# Altium project SAMV71_Xplained_Ultra.PrjPCB (part 3 of 5)

## Sheet SAMV71_Xplained_Ultra_Power_Supply.SchDoc: Power supply
size A3; Organization: ATMEL Norway; Address1: Vestre Rosten 79; Address2: N-7075 TILLER; Address3: NORWAY; DocumentNumber: A09-2407; Revision: 3; SheetNumber: 2; SheetTotal: 13; PageSetup: Record=PageOptions|CenterHorizontal=True|CenterVertical=True|PrintScale=1.01|XCorrection=1.00|YCorrection=1.00|PrintKind=1|BorderSize=5000000|LeftOffset=0|BottomOffset=0|Orientation=2|PaperLength=1000|PaperWidth=1000|Scale=100|PaperSource=7|PrintQuality=-4|MediaType=1|DitherType=10|PaperKind=A3 (297 x 420 mm)|PrintScaleMode=1
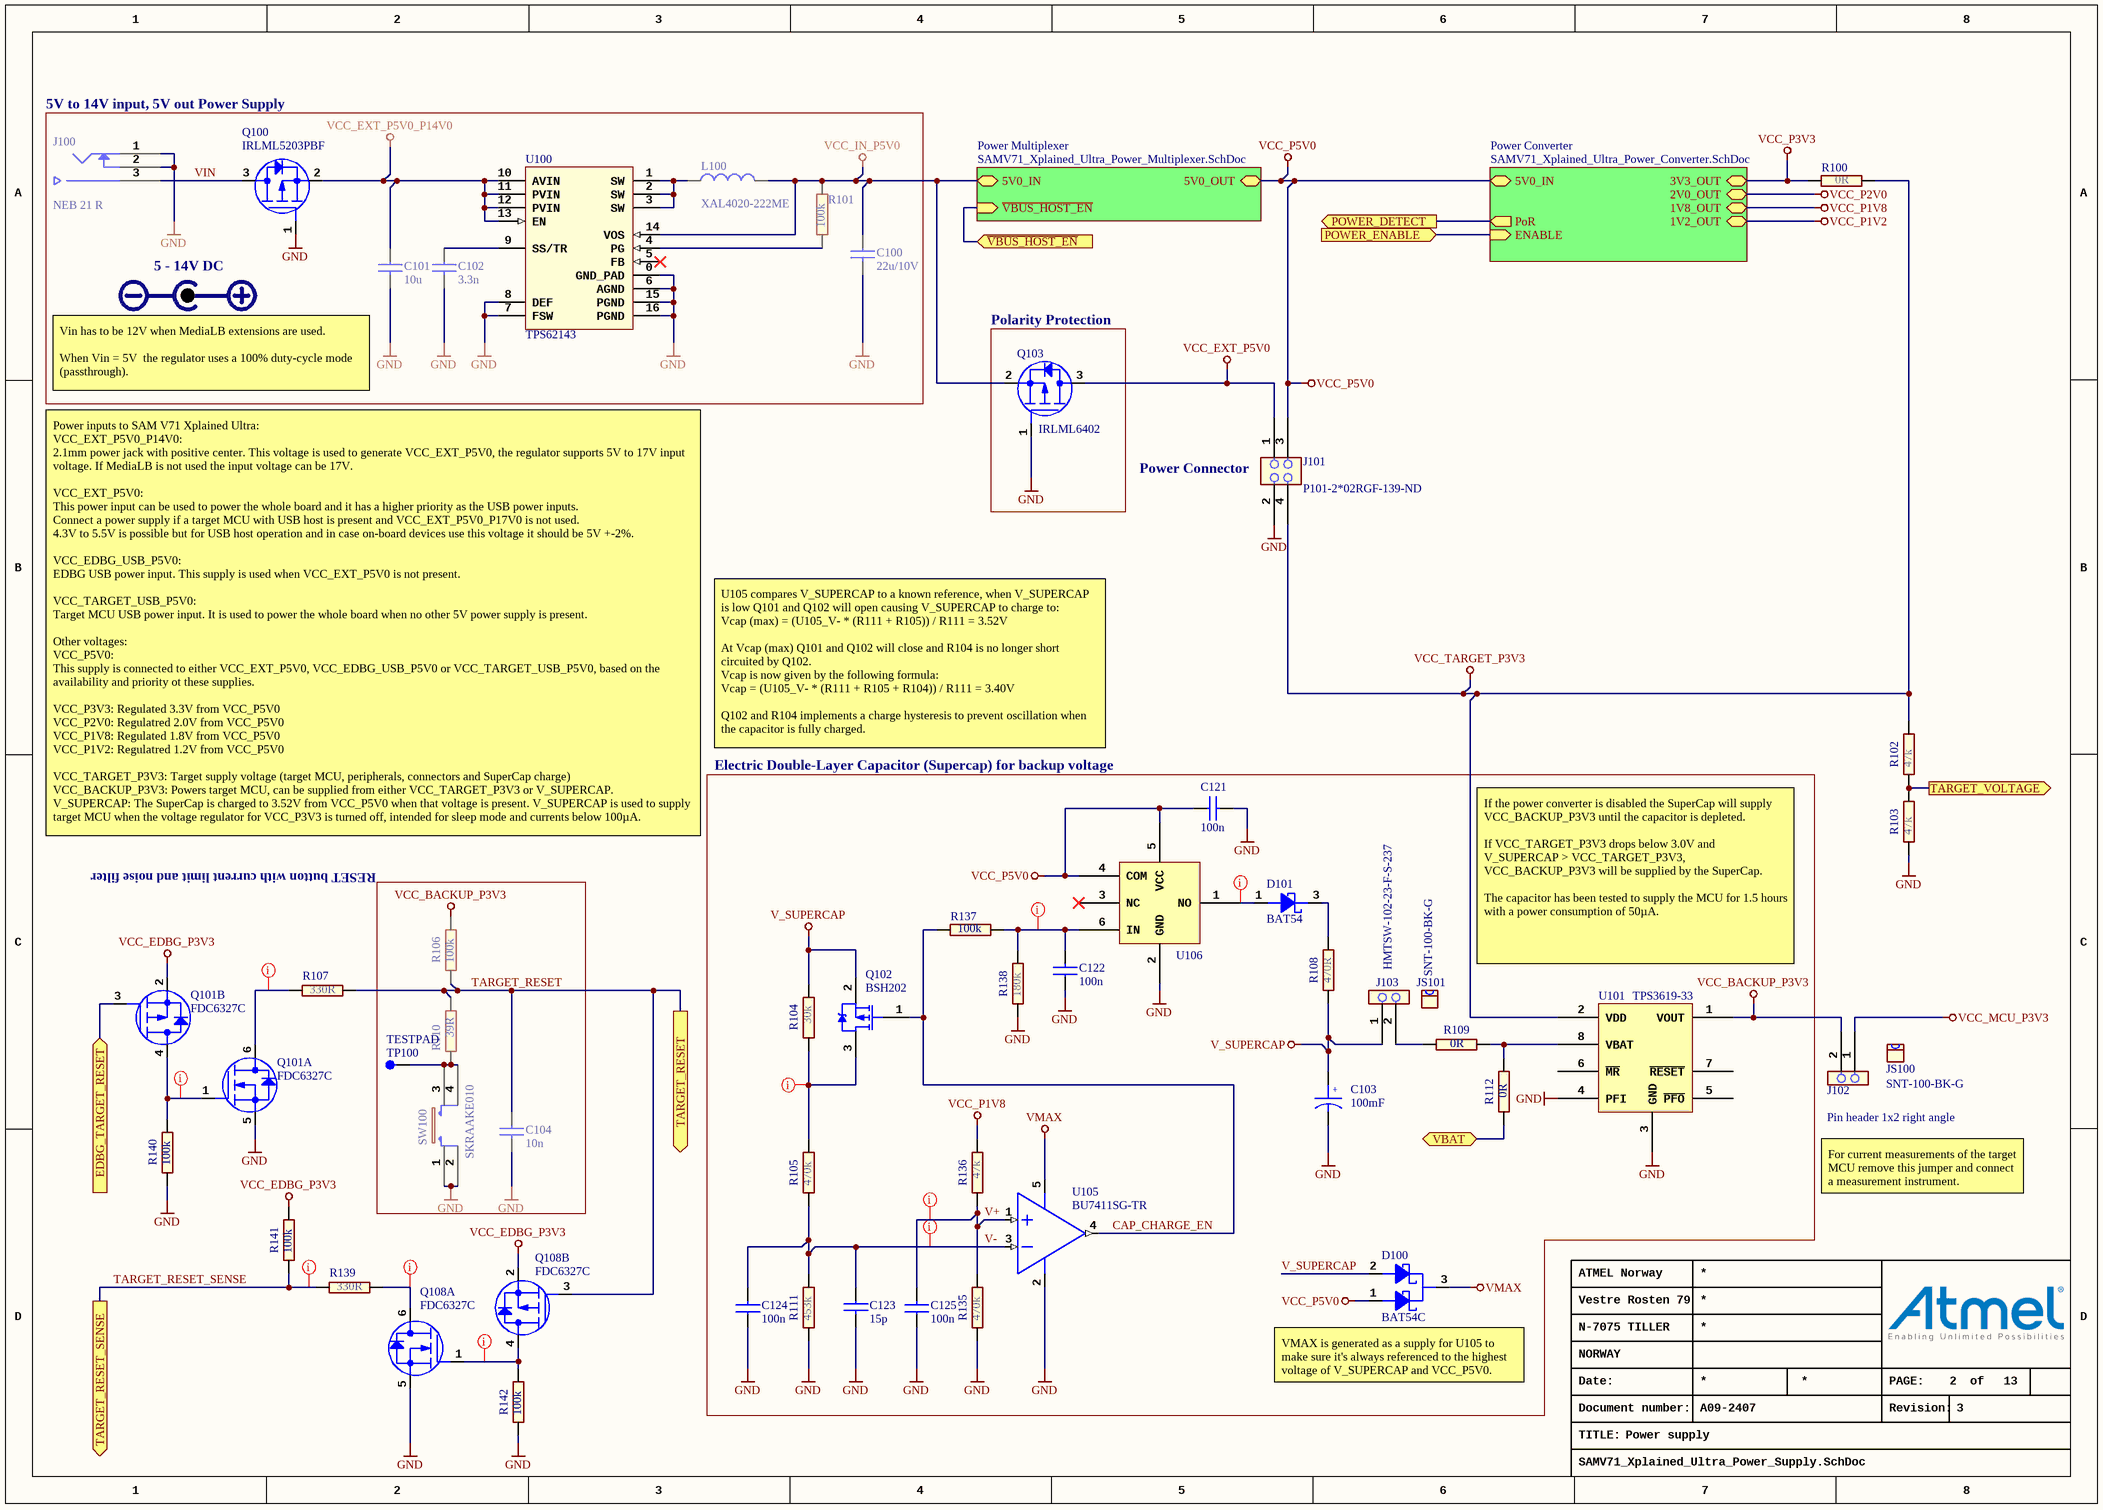
[diagram p4: SAMV71_Xplained_Ultra_Power_Supply.SchDoc]

### Parts
C100  value 22u/10V  [AP1-00003]
C101  value 10u  [AP1-00003]
C102  value 3.3n  [AP1-00001]
C103  value 100mF  [AP1-00122]  (hidden comment: For reflow soldering)
C104  value 10n  [AP1-00053]
C121  value 100n  [AP1-00001]
C122  value 100n  [AP1-00053]
C123  value 15p  [AP1-00001]
C124  value 100n  [AP1-00001]
C125  value 100n  [AP1-00001]
D100  value BAT54C  [AP5-00002]
D101  value BAT54  [AP4-00007]
J100  value NEB 21 R  [AP8-00853]
J101  value P101-2*02RGF-139-ND  [AP8-00628]
J102  value Pin header 1x2 right angle  [AP8-00367]
J103  value HMTSW-102-23-F-S-237  [AP8-00733]
JS100  value SNT-100-BK-G  [AP8-00525]
JS101  value SNT-100-BK-G  [AP8-00525]
L100  value XAL4020-222ME  [AP3-00119]
Q100  value IRLML5203PBF  [AP5-00002]
Q101  value FDC6327C  [AP5-00008]  (hidden comment: Farnell no: 9844856)  (parts A,B of 2)
Q102  value BSH202  [AP4-00018]
Q103  value IRLML6402  [AP5-00002]
Q108  value FDC6327C  [AP5-00008]  (hidden comment: Farnell no: 9844856)  (parts A,B of 2)
R100  value 0R  [AP2-00000]
R101  value 100k  [AP2-00000]
R102  value 47k  [AP2-00000]
R103  value 47k  [AP2-00000]
R104  value 30k  [AP2-00000]
R105  value 470k  [AP2-00000]
R106  value 100k  [AP2-00011]
R107  value 330R  [AP2-00011]
R108  value 470R  [AP2-00000]
R109  value 0R  [AP2-00000]
R110  value 39R  [AP2-00011]
R111  value 453k  [AP2-00000]
R112  value 0R  [AP2-00000]
R135  value 470k  [AP2-00000]
R136  value 47k  [AP2-00000]
R137  value 100k  [AP2-00011]
R138  value 180k  [AP2-00011]
R139  value 330R  [AP2-00011]
R140  value 100k  [AP2-00011]
R141  value 100k  [AP2-00011]
R142  value 100k  [AP2-00011]
SW100  value SKRAAKE010  [AP8-00137]  (hidden comment: Can be ordered in low volumes from Mouser)
TP100  value TESTPAD  [AP8-00010]  (no BOM)
U100  value TPS62143  [AP6-00313]  (hidden comment: 100% duty-cycle mode, supports input voltage close to 5V with 5V output!)
U101  value TPS3619-33  [AP6-00382]
U105  value BU7411SG-TR  [AP6-00087]
U106  (no value)  [AP6-00056]

### Blocks framed on the sheet
Polarity Protection: Q103
RESET button with current limit and noise filter: C104 R106 R110 SW100 TP100

### Sub-sheets
Power Converter = SAMV71_Xplained_Ultra_Power_Converter.SchDoc: 2V0_OUT (bidir), 3V3_OUT, 5V0_IN, 1V2_OUT, 1V8_OUT, ENABLE (in), PoR (out)
Power Multiplexer = SAMV71_Xplained_Ultra_Power_Multiplexer.SchDoc: ~{VBUS_HOST_EN} (in), 5V0_OUT, 5V0_IN

### Ports
EDBG_TARGET_RESET (in), POWER_DETECT (out), POWER_ENABLE (in), TARGET_RESET (out), TARGET_RESET_SENSE (out), TARGET_VOLTAGE (out), VBAT (bidir), ~{VBUS_HOST_EN} (in)

### Nets
GND: C100.2 C101.2 C102.2 C103.2 C104.2 C121.2 C122.1 C123.2 C124.1 C125.1 J100.1 J100.2 J101.2 Q100.1(G) Q101.5(S) Q103.1(G) Q108.5(S) R103.1 R111.1 R135.1 R138.1 R140.1 R142.1 SW100.1 SW100.2 U100.0(GND_PAD) U100.6(AGND) U100.7(FSW) U100.8(DEF) U100.15(PGND) U100.16(PGND) U101.3(GND) U101.4(PFI) U105.2(GND) U106.2(GND)
V_SUPERCAP: C103.1 D100.2(ANODE2) J103.1 Q102.2(S) R104.2 R108.2
VCC_BACKUP_P3V3: J102.2 R106.2 U101.1(VOUT)
VCC_EDBG_P3V3: Q101.2(S) Q108.2(S) R141.2
VCC_EXT_P5V0: J101.1 Q103.3(D)
VCC_EXT_P5V0_P14V0: C101.1 Q100.2(S) U100.10(AVIN) U100.11(PVIN) U100.12(PVIN) U100.13(EN)
VCC_IN_P5V0: C100.1 L100.2 Q103.2(S) R101.1 U100.14(VOS) ; sheet Power Multiplexer/5V0_IN
VCC_MCU_P3V3: J102.1
VCC_P1V8: R136.2 ; sheet Power Converter/1V8_OUT
VCC_P3V3: R100.1 ; sheet Power Converter/3V3_OUT
VCC_P5V0: C121.1 D100.1(ANODE1) J101.3 U106.4(COM) U106.5(VCC) ; sheet Power Multiplexer/5V0_OUT, sheet Power Converter/5V0_IN
VCC_TARGET_P3V3: J101.4 R100.2 R102.2 U101.2(VDD)
VMAX: D100.3(CATHODE) U105.5(VCC)
CAP_CHARGE_EN: Q102.1(G) R137.1 U105.4(OUT)
EDBG_ADC0: R102.1 R103.2 ; port TARGET_VOLTAGE
EDBG_TARGET_RESET: Q101.3(G) ; port EDBG_TARGET_RESET
PA01: port POWER_DETECT, sheet Power Converter/PoR
PC17: port POWER_ENABLE, sheet Power Converter/ENABLE
TARGET_RESET: C104.1 Q108.3(G) R106.1 R107.2 R110.2 ; port TARGET_RESET
TARGET_RESET_SENSE: R139.1 R141.1 ; port TARGET_RESET_SENSE
TARGET_USB_ID: port ~{VBUS_HOST_EN}, sheet Power Multiplexer/~{VBUS_HOST_EN}
V+: C125.2 R135.2 R136.1 U105.1(IN+)
V-: C123.1 C124.2 R105.1 R111.2 U105.3(IN-)
VBAT: R112.1 ; port VBAT
VIN: J100.3 Q100.3(D)
NetC102_1: C102.1 U100.9(SS/TR)
NetC122_2: C122.2 R137.2 R138.2 U106.6(IN)
NetD101_1: D101.1(ANODE) U106.1(NO)
NetD101_3: D101.3(CATHODE) R108.1
NetJ103_2: J103.2 R109.1
NetL100_1: L100.1 U100.1(SW) U100.2(SW) U100.3(SW)
NetQ101_1: Q101.1(G) Q101.4(D) R140.2
NetQ101_6: Q101.6(D) R107.1
NetQ102_3: Q102.3(D) R104.1 R105.2
NetQ108_1: Q108.1(G) Q108.4(D) R142.2
NetQ108_6: Q108.6(D) R139.2
NetR101_2: R101.2 U100.4(PG)
NetR109_2: R109.2 R112.2 U101.8(VBAT)
NetR110_1: R110.1 SW100.3 SW100.4 TP100.1

Not connected (* = marked no-connect by the designer): U100 5(FB)*; U101 5(~{PFO}) 6(~{MR}) 7(~{RESET}); U106 3(NC)*

### Layout directives
rule Fabrication Testpoint Usage [Testpoint - Not Allowed    Multiple - Not Allowed]; rule Assembly Testpoint Usage [Testpoint - Not Allowed    Multiple - Not Allowed]: NetC122_2, NetD101_1, NetQ102_3, V+, V-
rule Assembly Testpoint Usage [Testpoint - Not Allowed    Multiple - Not Allowed]; rule Fabrication Testpoint Usage [Testpoint - Not Allowed    Multiple - Not Allowed]: NetQ101_1, NetQ101_6, NetQ108_1, NetQ108_6, TARGET_RESET_SENSE

### Notes on the sheet
- (near J100) 5V to 14V input, 5V out Power Supply
- (near Q100) 5 - 14V DC
- (near C101) Vin has to be 12V when MediaLB extensions are used.
  When Vin = 5V  the regulator uses a 100% duty-cycle mode (passthrough).
- (near J101) Power Connector
- Electric Double-Layer Capacitor (Supercap) for backup voltage
- U105 compares V_SUPERCAP to a known reference, when V_SUPERCAP is low Q101 and Q102 will open causing V_SUPERCAP to charge to:
  Vcap (max) = (U105_V- * (R111 + R105)) / R111 = 3.52V
  At Vcap (max) Q101 and Q102 will close and R104 is no longer short circuited by Q102.
  Vcap is now given by the following formula:
  Vcap = (U105_V- * (R111 + R105 + R104)) / R111 = 3.40V
  Q102 and R104 implements a charge hysteresis to prevent oscillation when the capacitor is fully charged.
- Power inputs to SAM V71 Xplained Ultra:
  VCC_EXT_P5V0_P14V0:
  2.1mm power jack with positive center. This voltage is used to generate VCC_EXT_P5V0, the regulator supports 5V to 17V input voltage. If MediaLB is not used the input voltage can be 17V.
  VCC_EXT_P5V0:
  This power input can be used to power the whole board and it has a higher priority as the USB power inputs.
  Connect a power supply if a target MCU with USB host is present and VCC_EXT_P5V0_P17V0 is not used.
  4.3V to 5.5V is possible but for USB host operation and in case on-board devices use this voltage it should be 5V +-2%.
  VCC_EDBG_USB_P5V0:
  EDBG USB power input. This supply is used when VCC_EXT_P5V0 is not present.
  VCC_TARGET_USB_P5V0:
  Target MCU USB power input. It is used to power the whole board when no other 5V power supply is present.
  Other voltages:
  VCC_P5V0:
  This supply is connected to either VCC_EXT_P5V0, VCC_EDBG_USB_P5V0 or VCC_TARGET_USB_P5V0, based on the availability and priority ot these supplies.
  VCC_P3V3: Regulated 3.3V from VCC_P5V0
  VCC_P2V0: Regulatred 2.0V from VCC_P5V0
  VCC_P1V8: Regulated 1.8V from VCC_P5V0
  VCC_P1V2: Regulatred 1.2V from VCC_P5V0
  VCC_TARGET_P3V3: Target supply voltage (target MCU, peripherals, connectors and SuperCap charge)
  VCC_BACKUP_P3V3: Powers target MCU, can be supplied from either VCC_TARGET_P3V3 or V_SUPERCAP.
  V_SUPERCAP: The SuperCap is charged to 3.52V from VCC_P5V0 when that voltage is present. V_SUPERCAP is used to supply target MCU when the voltage regulator for VCC_P3V3 is turned off, intended for sleep mode and currents below 100µA.
- If the power converter is disabled the SuperCap will supply VCC_BACKUP_P3V3 until the capacitor is depleted.
  If VCC_TARGET_P3V3 drops below 3.0V and V_SUPERCAP > VCC_TARGET_P3V3, VCC_BACKUP_P3V3 will be supplied by the SuperCap.
  The capacitor has been tested to supply the MCU for 1.5 hours with a power consumption of 50µA.
- For current measurements of the target MCU remove this jumper and connect a measurement instrument.
- (near D100) VMAX is generated as a supply for U105 to make sure it's always referenced to the highest voltage of V_SUPERCAP and VCC_P5V0.
- Date:
- PAGE:
- of
- TITLE:
- Document number:
- Revision:
- (in symbol A01-0679) +

### Library data of the parts
C100 = A01-0500: Ceramic capacitor, SMD 0805, X5R, 10V, Â±20%; PartGroup: Capacitors,Ceramic,SMD 0805; Manufacturer: tdk; MPN: C2012X5R1A226M/0.85; TemperatureRange: -55Â°C to +85Â°C; AN: A01-0500; Height: 0,949999988079071
C101 = A01-0634: Ceramic capacitor, SMD 0805, X5R, 25V, Â±10%; PartGroup: Capacitors,Ceramic,SMD 0805; Manufacturer: Murata; MPN: GRM21BR61E106KA73L; TemperatureRange: -55 Â°C to +85 Â°C; AN: A01-0634; Tolerance: Â±10%; Height: 1,25
C102 = A01-0044: Ceramic capacitor, SMD 0402, X7R, 25V, +/-10%; PartGroup: Capacitors,Ceramic,SMD 0402; TemperatureRange: -55 - +125 deg C; AN: A01-0044; Tolerance: 25V, +/-10%; Height: 0,550000011920929
C103 = A01-0679: Electric Double-Layer (Supercapacitor), 100mF, SMD, 10.5mm diameter, 25Î© ESR; PartGroup: Capacitors,Other; Manufacturer: Kemet; MPN: FC0H104ZFTBR24; Tolerance: -20/+80%; TemperatureRange: -25Â°C to +70Â°C; AN: A01-0679; Height: 5,5
C104 = A01-0050: Ceramic capacitor, SMD 0402, X7R, 25V, +/-10%; PartGroup: Capacitors,Ceramic,SMD 0402; TemperatureRange: -55 - +125 deg C; AN: A01-0050; Tolerance: 25V, +/-10%; Height: 0,550000011920929
C121 C122 C124 C125 = A01-0246: Ceramic capacitor, SMD 0402, X7R, 16V, +/-10%; PartGroup: Capacitors,Ceramic,SMD 0402; Manufacturer: Kemet; MPN: C0402C104K4RACTU; TemperatureRange: -55 - +125 deg C; AN: A01-0246; Tolerance: 16V, +/-10%; Height: 0,5
C123 = A01-0017: Ceramic capacitor, SMD 0402, NP0, 50V, +/-5%; PartGroup: Capacitors,Ceramic,SMD 0402; TemperatureRange: -55 - +125 deg C; AN: A01-0017; Tolerance: 50V, +/-5%; Height: 0,550000011920929
D100 = A04-0064: Schottky double Diodes, NXP, SOT23-3; PartGroup: Diodes,Schottky; AN: A04-0064; Height: 1; Manufacturer: NXP; MPN: BAT54C
D101 = A04-0001: Schottky diode, V(rrm)=30V, I(f)=0.1A, V(f)=0.4V (at If = 0.01A), I(r)=0.5uA (at Vrrm), t(rr)=5ns, SMD SOT23; PartGroup: Diodes,Schottky; Manufacturer: Philips; NC: 2; TemperatureRange: -40 - +85 deg C; AN: A04-0001; Height: 1,10000002384186; MPN: BAT54
J100 = A08-2120: Through hole DC jack 2.1mm, 12V, 3A; PartGroup: Mechanical devices,Connectors,Power; Manufacturer: Lumberg; TemperatureRange: -20Â°C to +70Â°C; AN: A08-2120; Height: 11; MPN: NEB 21 R
J101 = A08-1519: Pin header, 2x2, Right Angle, 2.54mm, THT, Pin In Paste; PartGroup: Mechanical devices,Connectors,Pin headers; Manufacturer: Pro-data International Corp; AN: A08-1519; Height: 5,07999992370605; MPN: P101-2*02RGF-139-ND
J102 = A08-0764: 1x2 pin header, right angle, 2.54 mm pitch, through-hole; PartGroup: Mechanical devices,Connectors,Pin headers; Manufacturer: Pro-data International Corp; MPN: 2213R-2G; AN: A08-0764; Height: 2,53999996185303
J103 = A08-1754: 1x2 pin header, 2.54mm pitch, Pin-in-Paste THM; PartGroup: Mechanical devices,Connectors,Pin headers; Manufacturer: SAMTEC; TemperatureRange: - 55 deg C to + 125 deg C; AN: A08-1754; Height: 6,09999990463257; MPN: HMTSW-102-23-F-S-237
JS100 JS101 = A08-0543: Jumper cap for 2.54mm pinheader; PartGroup: Mechanical devices,Mounting accessories,Other; Manufacturer: SAMTEC; AN: A08-0543; MPN: SNT-100-BK-G
L100 = A03-0197: 2.2ÂµH Shielded Power Inductor, 4x4x2mm, Isat=5.6A , Irms=4.0A , DCR=35.2mÎ©; PartGroup: Inductors,Power Inductors; Manufacturer: Coilcraft; MPN: XAL4020-222MEC; Tolerance: 20%; TemperatureRange: â€“40Â°C to +125Â°C; AN: A03-0197; Height: 2
Q100 = A05-0023: P-ch. MOSFET. -30V, -3.0A continuous, -24A Peak. RDS(ON)=0.098Ohm@VGS=-10V, RDS(ON)=0.165Ohm@VGS=-4.5V, -2.5V<VGS(th)<-1.0V; PartGroup: Transistors,Power FET,SMD; Manufacturer: International Rectifier; TemperatureRange: -40C to +125; AN: A05-0023; Height: 1,12000000476837; MPN: IRLML5203PBF
Q101 Q108 = A05-0040: Dual N/P-ch MOSFET, 20V, 2.7A/-1.9A cont, 8A/-8A pulse, RDS(ON)<0.08/0.17Ohm@VGS=4.5V, VGS(th)<1.5/-1.5V, SSOT6; PartGroup: Transistors,Power FET,SMD; Manufacturer: Fairchild; TemperatureRange: -55 - +150 deg C; AN: A05-0040; Height: 1,10000002384186; MPN: FDC6327C
Q102 = A05-0134: P-channel Power MOSFET,30V, 520mA continuous drain current; PartGroup: Transistors,Power FET,SMD; Manufacturer: NXP; Design comment: *; AN: A05-0134; MPN: BSH202
Q103 = A05-0087: P-ch. MOSFET. -30V, -3.7A continuous,RDS(ON)=0.05Ohm@VGS=-4,5V, RDS(ON)=0.08Ohm@VGS=-2.5V; PartGroup: Transistors,Power FET,SMD; Manufacturer: International Rectifier; MPN: IRLML6402PBF; TemperatureRange: -55 - +150 deg C; AN: A05-0087; Height: 1,14999997615814
R100 = A02-0163: Thick film resistor, SMD 0402, 1/16W, 1%; PartGroup: Resistors,SMD,0402 1%; Manufacturer: (n/a); MPN: RMCF0402ZT0R00; TemperatureRange: -55 - +125 deg C; AN: A02-0163; Tolerance: 1 %; Height: 0,349999994039536
R101 R106 R137 R140-R142 = A02-0260: Thick film resistor, SMD 0402, 1/16W, 1%; PartGroup: Resistors,SMD,0402 1%; TemperatureRange: -55ï¿½ to +125ï¿½C; AN: A02-0260; Tolerance: 1 %; Height: 0,349999994039536
R102 R103 R136 = A02-0252: Thick film resistor, SMD 0402, 1/16W, 1%; PartGroup: Resistors,SMD,0402 1%; TemperatureRange: -55 - +125 deg C; AN: A02-0252; Tolerance: 1 %; Height: 0,349999994039536
R104 = A02-0247: Thick film resistor, SMD 0402, 1/16W, 1%; PartGroup: Resistors,SMD,0402 1%; TemperatureRange: -55ï¿½ to +155ï¿½C; AN: A02-0247; Tolerance: 1 %; Height: 0,349999994039536
R105 R135 = A02-0276: Thick film resistor, SMD 0402, 1/16W, 1%; PartGroup: Resistors,SMD,0402 1%; TemperatureRange: -55 - +125 deg C; AN: A02-0276; Tolerance: 1 %; Height: 0,349999994039536
R107 R139 = A02-0200: Thick film resistor, SMD 0402, 1/16W, 1%; PartGroup: Resistors,SMD,0402 1%; TemperatureRange: -55 - +125 deg C; AN: A02-0200; Tolerance: 1 %; Height: 0,349999994039536
R108 = A02-0204: Thick film resistor, SMD 0402, 1/16W, 1%; PartGroup: Resistors,SMD,0402 1%; TemperatureRange: -55 - +125 deg C; AN: A02-0204; Tolerance: 1 %; Height: 0,349999994039536
R109 R112 = A02-0163: RES 0.0 OHM 1/16W 0402 SMD; PartGroup: Resistors,SMD,0402 1%; Manufacturer: (n/a); MPN: RMCF0402ZT0R00; Tolerance: 1 %; TemperatureRange: -55 - +125 deg C; AN: A02-0163; Height: 0,349999994039536
R110 = A02-0178: Thick film resistor, SMD 0402, 1/16W, 1%; PartGroup: Resistors,SMD,0402 1%; TemperatureRange: -55 - +125 deg C; AN: A02-0178; Tolerance: 1 %; Height: 0,349999994039536
R111 = A02-0925: Thick film resistor, SMD 0402, 1/16W, 1%; PartGroup: Resistors,SMD,0402 1%; TemperatureRange: -55 - +125 deg C; AN: A02-0925; Tolerance: 1 %; Height: 0,349999994039536
R138 = A02-0266: Thick film resistor, SMD 0402, 1/16W, 1%; PartGroup: Resistors,SMD,0402 1%; TemperatureRange: -55 - +125 deg C; AN: A02-0266; Tolerance: 1 %; Height: 0,349999994039536
SW100 = A08-0790: 6.2x6.2 mm SMD tact switch, same as A08-0091 but less force is needed; PartGroup: Mechanical devices,Switches,SMD; Manufacturer: ALPS; TemperatureRange: -30 - +90 deg C; AN: A08-0790; Height: 5,09999990463257; MPN: SKRAAKE010
TP100 = A08-0004: Single SMD testpad; PartGroup: Mechanical devices,Connectors,Test points; AN: A08-0004; Height: 0
U100 = A06-1167: 5V to 17V in, 5V 2A out, Step-Down Converter; PartGroup: Integrated Circuits,Regulators,Switched; Manufacturer: Texas Instruments; MPN: TPS62143RGTR; TemperatureRange: -40C to 85C; AN: A06-1167; Height: 1
U101 = A06-1100: Backup battery supervisors for RAM retention; PartGroup: Integrated Circuits,Special function,Supervisor; Manufacturer: Texas Instruments; MPN: TPS3619-33DGK; Design comment: *; AN: A06-1100
U105 = A06-1239: Single, Low Voltage (1.6-5.5V), Low Power (0.35ÂµA), low cost; PartGroup: Integrated Circuits,General linear,OP-AMP; Manufacturer: ROHM; TemperatureRange: -40Â°C to +105Â°C; AN: A06-1239; Height: 1,25; MPN: BU7411SG-TR
U106 = A06-1104: 1.65V to 5.5V SPDT Analog switch; PartGroup: Integrated Circuits,General linear,Analog switch, bus switch and MUX; Manufacturer: Texas Instruments; Value: TS5A3160DBVR; Design comment: *; AN: A06-1104; MPN: TS5A3160DBVR

## Sheet SAMV71_Xplained_Ultra_Power_Multiplexer.SchDoc: Power Multiplexer
size A3; Organization: ATMEL Norway; Address1: Vestre Rosten 79; Address2: N-7075 TILLER; Address3: NORWAY; DocumentNumber: A09-2407; Revision: 3; SheetNumber: 3; SheetTotal: 13; PageSetup: Record=PageOptions|CenterHorizontal=True|CenterVertical=True|PrintScale=1.01|XCorrection=1.00|YCorrection=1.00|PrintKind=1|BorderSize=5000000|LeftOffset=0|BottomOffset=0|Orientation=2|PaperLength=1000|PaperWidth=1000|Scale=100|PaperSource=7|PrintQuality=-4|MediaType=1|DitherType=10|PaperKind=A3 (297 x 420 mm)|PrintScaleMode=1
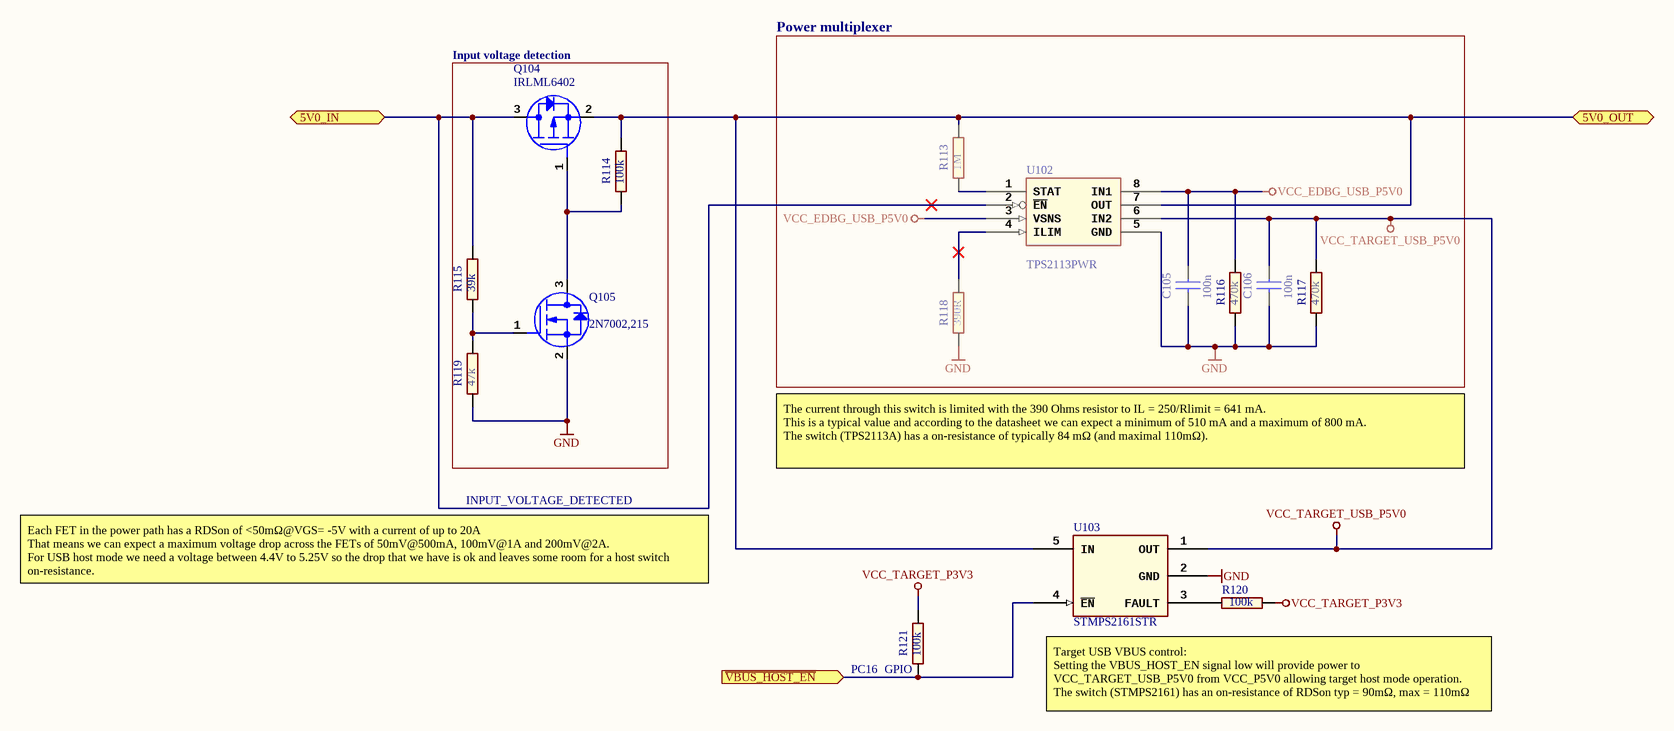
[diagram p5: SAMV71_Xplained_Ultra_Power_Multiplexer.SchDoc]

### Parts
C105  value 100n  [AP1-00001]
C106  value 100n  [AP1-00001]
Q104  value IRLML6402  [AP5-00002]
Q105  value 2N7002,215  [AP5-00002]
R113  value 1M  [AP2-00000]
R114  value 100k  [AP2-00000]
R115  value 39k  [AP2-00000]
R116  value 470k  [AP2-00000]
R117  value 470k  [AP2-00000]
R118  value 390R  [AP2-00000]
R119  value 47k  [AP2-00000]
R120  value 100k  [AP2-00011]
R121  value 100k  [AP2-00011]
U102  value TPS2113PWR  [AP6-00054]
U103  value STMPS2161STR  [AP6-00087]

### Blocks framed on the sheet
Input voltage detection: Q104 Q105 R114 R115 R119
Power multiplexer: C105 C106 R113 R116-R118 U102

### Ports
5V0_IN, 5V0_OUT, ~{VBUS_HOST_EN} (in)

### Nets
GND: C105.2 C106.2 Q105.2(S) R116.1 R117.1 R118.1 R119.1 U102.5(GND) U103.2(GND)
VCC_EDBG_USB_P5V0: C105.1 R116.2 U102.3(VSNS) U102.8(IN1)
VCC_IN_P5V0: Q104.3(D) R115.2 U102.2(~{EN}) ; port 5V0_IN
VCC_P5V0: Q104.2(S) R113.2 R114.2 U102.7(OUT) U103.5(IN) ; port 5V0_OUT
VCC_TARGET_P3V3: R120.1 R121.2
VCC_TARGET_USB_P5V0: C106.1 R117.2 U102.6(IN2) U103.1(OUT)
TARGET_USB_ID: R121.1 U103.4(~{EN}) ; port ~{VBUS_HOST_EN}
NetQ104_1: Q104.1(G) Q105.3(D) R114.1
NetQ105_1: Q105.1(G) R115.1 R119.2
NetR113_1: R113.1 U102.1(STAT)
NetR118_2: R118.2 U102.4(ILIM)
NetR120_2: R120.2 U103.3(FAULT)

### Notes on the sheet
- The current through this switch is limited with the 390 Ohms resistor to IL = 250/Rlimit = 641 mA.
  This is a typical value and according to the datasheet we can expect a minimum of 510 mA and a maximum of 800 mA.
  The switch (TPS2113A) has a on-resistance of typically 84 mΩ (and maximal 110mΩ).
- INPUT_VOLTAGE_DETECTED
- Each FET in the power path has a RDSon of <50mΩ@VGS= -5V with a current of up to 20A
  That means we can expect a maximum voltage drop across the FETs of 50mV@500mA, 100mV@1A and 200mV@2A.
  For USB host mode we need a voltage between 4.4V to 5.25V so the drop that we have is ok and leaves some room for a host switch on-resistance.
- (near R121) PC16
- (near R121) GPIO
- Target USB VBUS control:
  Setting the VBUS_HOST_EN signal low will provide power to VCC_TARGET_USB_P5V0 from VCC_P5V0 allowing target host mode operation.
  The switch (STMPS2161) has an on-resistance of RDSon typ = 90mΩ, max = 110mΩ
- Date:
- PAGE:
- of
- TITLE:
- Document number:
- Revision:

### Library data of the parts
C105 C106 = A01-0246: as C121 on sheet SAMV71_Xplained_Ultra_Power_Supply; AN: A01-0246; Tolerance: 16V, +/-10%; Height: 0,5
Q104 = A05-0087: as Q103 on sheet SAMV71_Xplained_Ultra_Power_Supply; AN: A05-0087; Height: 1,14999997615814
Q105 = A05-0085: N-Channel MOSFET. 60V, 0.300A continuous, 1.2A Peak. RDS(ON) = 3.8Ohm@VGS=4.5V, VGS(th)<2.5V; PartGroup: Transistors,Small signal FET,SMD; Manufacturer: NXP; TemperatureRange: -65 to 150 deg C; AN: A05-0085; Height: 1,10000002384186; MPN: 2N7002,215
R113 = A02-0284: Thick film resistor, SMD 0402, 1/16W, 1%; PartGroup: Resistors,SMD,0402 1%; TemperatureRange: -55 - +125 deg C; AN: A02-0284; Tolerance: 1 %; Height: 0,349999994039536
R114 R120 R121 = A02-0260: as R101 on sheet SAMV71_Xplained_Ultra_Power_Supply; AN: A02-0260; Tolerance: 1 %; Height: 0,349999994039536
R115 = A02-0250: Thick film resistor, SMD 0402, 1/16W, 1%; PartGroup: Resistors,SMD,0402 1%; TemperatureRange: -55 - +125 deg C; AN: A02-0250; Tolerance: 1 %; Height: 0,349999994039536
R116 R117 = A02-0276: as R105 on sheet SAMV71_Xplained_Ultra_Power_Supply; AN: A02-0276; Tolerance: 1 %; Height: 0,349999994039536
R118 = A02-0202: Thick film resistor, SMD 0402, 1/16W, 1%; PartGroup: Resistors,SMD,0402 1%; TemperatureRange: -55 - +125 deg C; AN: A02-0202; Tolerance: 1 %; Height: 0,349999994039536
R119 = A02-0252: as R102 on sheet SAMV71_Xplained_Ultra_Power_Supply; AN: A02-0252; Tolerance: 1 %; Height: 0,349999994039536
U102 = A06-0068: Autoswitching 2:1 Power Mux; PartGroup: Integrated Circuits,General linear,Analog switch, bus switch and MUX; Manufacturer: Texas Instruments; TemperatureRange: -40 - + 125 deg C; AN: A06-0068; Height: 1,20000004768372; MPN: TPS2113PWR
U103 = A06-1087: Single channel power switch, 1A, reverse block, active low enabled.; PartGroup: Integrated Circuits,General linear,Analog switch, bus switch and MUX; Manufacturer: ST; Tolerance: 2.7 to 5.5V; TemperatureRange: -40Â°C to +85Â°C; Design comment: *; AN: A06-1087; Height: 1,45000004768372; MPN: STMPS2161STR

## Sheet SAMV71_Xplained_Ultra_Power_Converter.SchDoc: Power Converter
size A3; Organization: ATMEL Norway; Address1: Vestre Rosten 79; Address2: N-7075 TILLER; Address3: NORWAY; DocumentNumber: A09-2407; Revision: 3; SheetNumber: 4; SheetTotal: 13; PageSetup: Record=PageOptions|CenterHorizontal=True|CenterVertical=True|PrintScale=1.01|XCorrection=1.00|YCorrection=1.00|PrintKind=1|BorderSize=5000000|LeftOffset=0|BottomOffset=0|Orientation=2|PaperLength=1000|PaperWidth=1000|Scale=100|PaperSource=7|PrintQuality=-4|MediaType=1|DitherType=10|PaperKind=A3 (297 x 420 mm)|PrintScaleMode=1
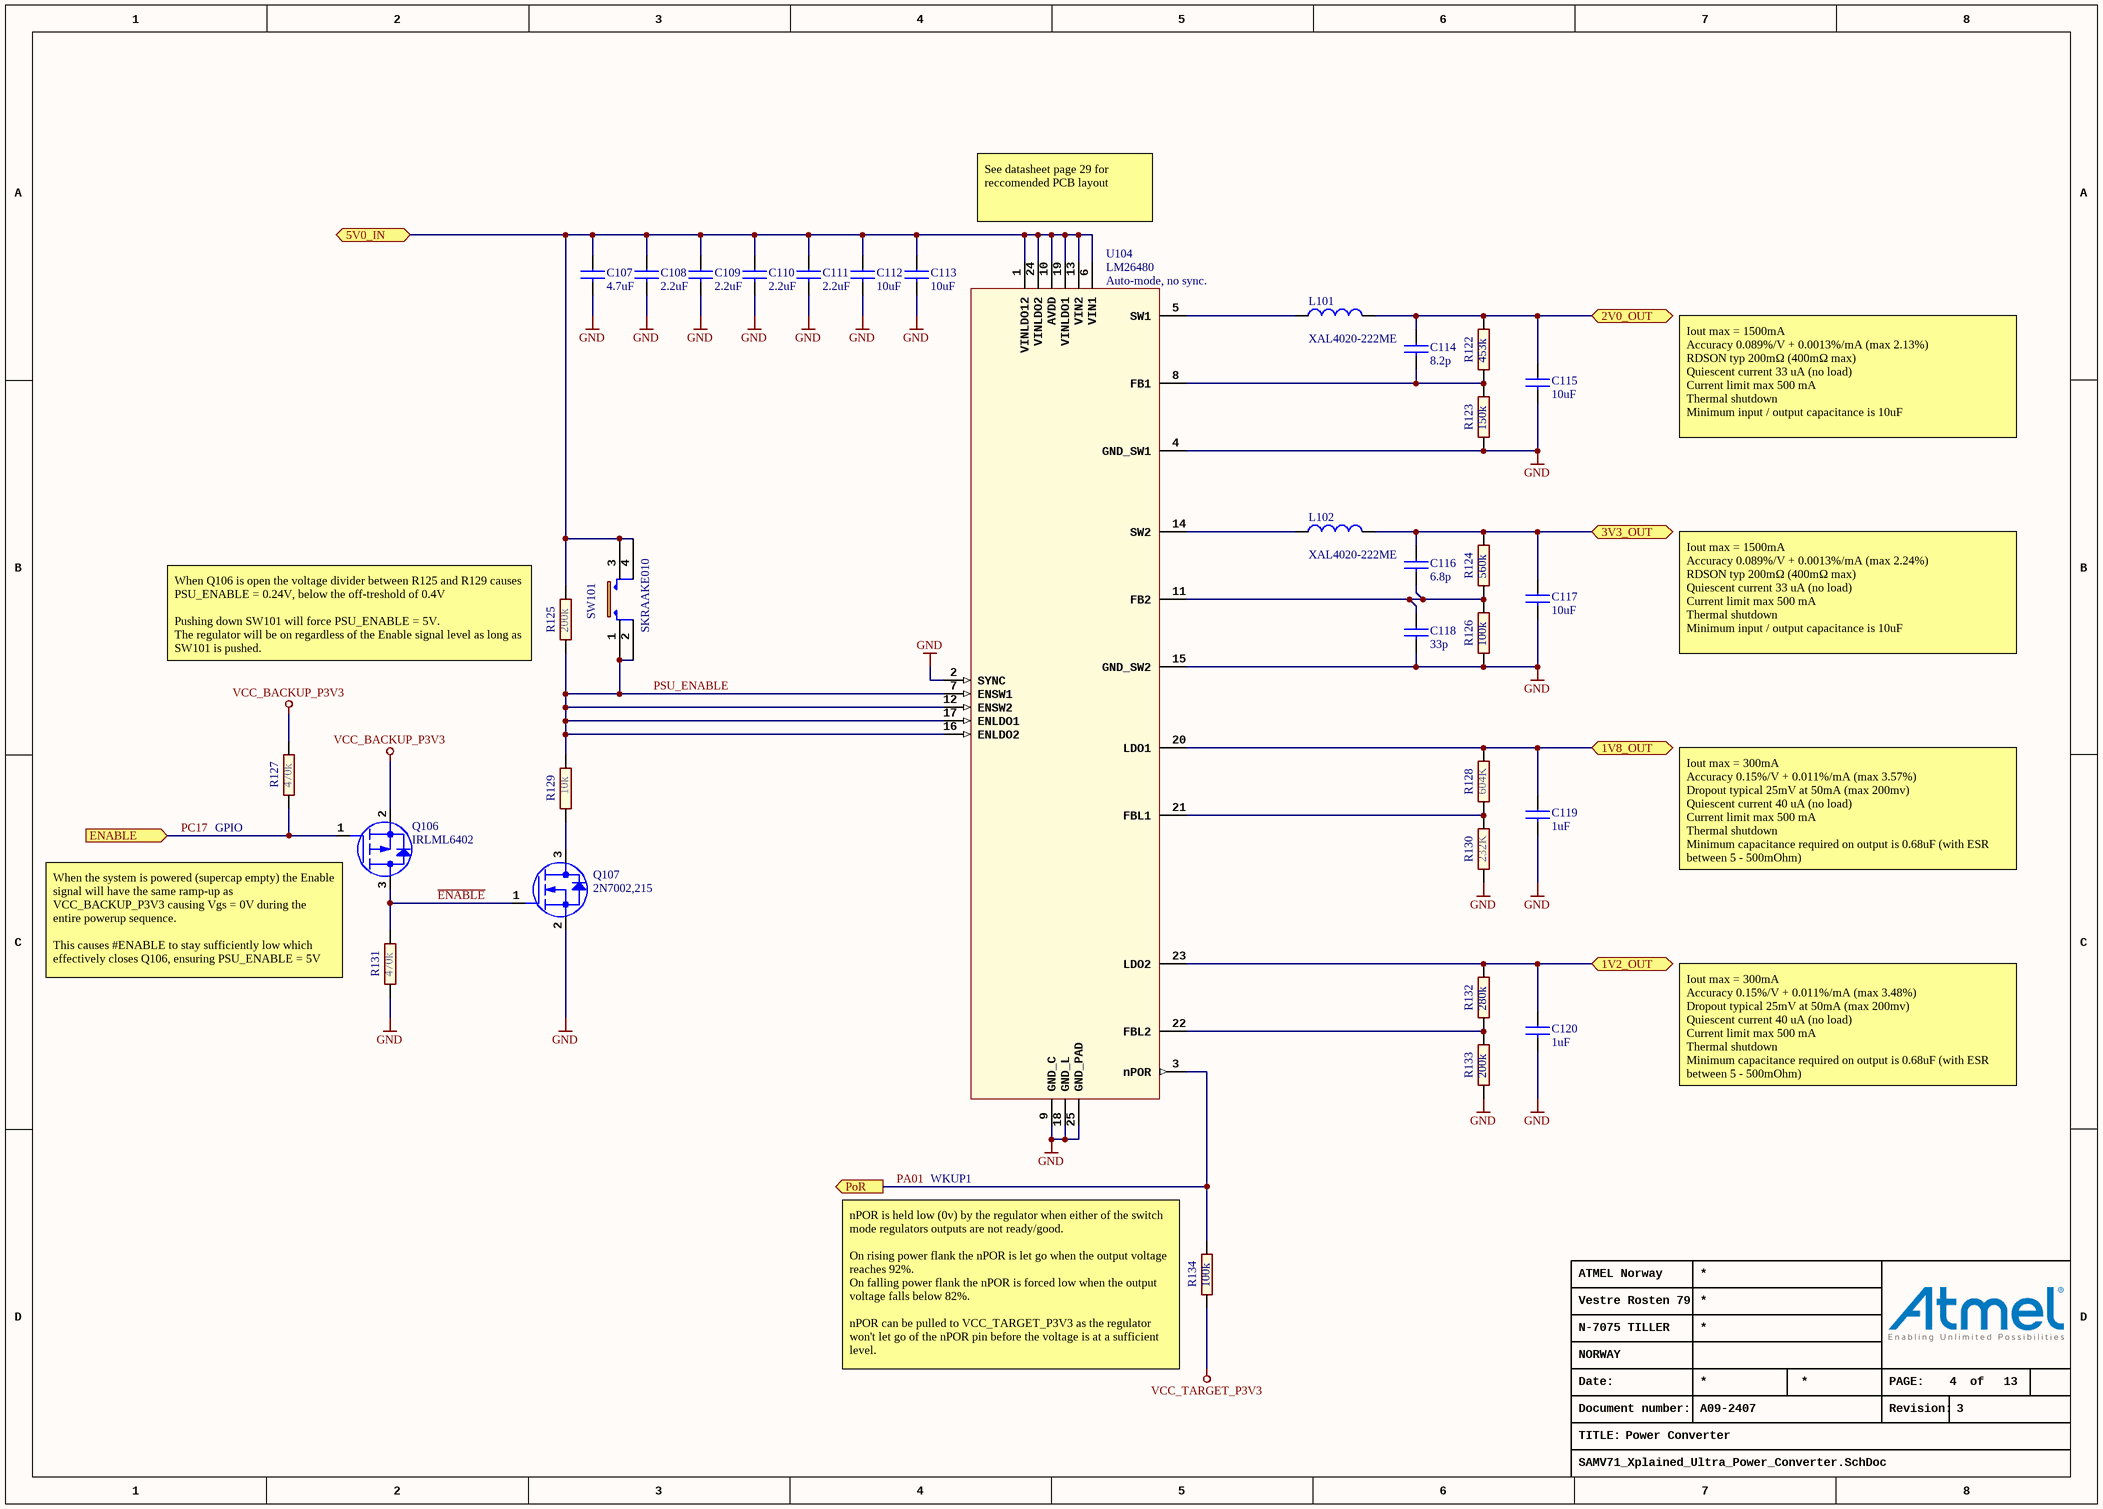
[diagram p6: SAMV71_Xplained_Ultra_Power_Converter.SchDoc]

### Parts
C107  value 4.7uF  [AP1-00039]
C108  value 2.2uF  [AP1-00053]  (hidden comment: Farnell no: 1288200)
C109  value 2.2uF  [AP1-00053]  (hidden comment: Farnell no: 1288200)
C110  value 2.2uF  [AP1-00053]  (hidden comment: Farnell no: 1288200)
C111  value 2.2uF  [AP1-00053]  (hidden comment: Farnell no: 1288200)
C112  value 10uF  [AP1-00041]
C113  value 10uF  [AP1-00041]
C114  value 8.2p  [AP1-00053]
C115  value 10uF  [AP1-00041]
C116  value 6.8p  [AP1-00053]
C117  value 10uF  [AP1-00041]
C118  value 33p  [AP1-00053]
C119  value 1uF  [AP1-00053]
C120  value 1uF  [AP1-00053]
L101  value XAL4020-222ME  [AP3-00119]
L102  value XAL4020-222ME  [AP3-00119]
Q106  value IRLML6402  [AP5-00002]
Q107  value 2N7002,215  [AP5-00002]
R122  value 453k  [AP2-00011]
R123  value 150k  [AP2-00011]
R124  value 560k  [AP2-00011]
R125  value 200k  [AP2-00011]
R126  value 100k  [AP2-00011]
R127  value 470k  [AP2-00011]
R128  value 604K  [AP2-00011]
R129  value 10k  [AP2-00011]
R130  value 232K  [AP2-00011]
R131  value 470k  [AP2-00011]
R132  value 280k  [AP2-00011]
R133  value 200k  [AP2-00011]
R134  value 100k  [AP2-00011]
SW101  value SKRAAKE010  [AP8-00137]  (hidden comment: Can be ordered in low volumes from Mouser)
U104  Auto-mode, no sync.  value LM26480  [AP6-00380]

### Ports
1V2_OUT, 1V8_OUT, 2V0_OUT (bidir), 3V3_OUT, 5V0_IN, ENABLE (in), PoR (out)

### Nets
GND: C107.2 C108.2 C109.2 C110.2 C111.2 C112.2 C113.2 C115.2 C117.2 C118.2 C119.2 C120.2 Q107.2(S) R123.1 R126.2 R130.1 R131.1 R133.1 U104.2(SYNC) U104.4(GND_SW1) U104.9(GND_C) U104.15(GND_SW2) U104.18(GND_L) U104.25(GND_PAD)
VCC_BACKUP_P3V3: Q106.2(S) R127.2
VCC_P1V2: C120.1 R132.2 U104.23(LDO2) ; port 1V2_OUT
VCC_P1V8: C119.1 R128.2 U104.20(LDO1) ; port 1V8_OUT
VCC_P2V0: C114.1 C115.1 L101.2 R122.2 ; port 2V0_OUT
VCC_P3V3: C116.1 C117.1 L102.2 R124.2 ; port 3V3_OUT
VCC_P5V0: C107.1 C108.1 C109.1 C110.1 C111.1 C112.1 C113.1 R125.2 SW101.3 SW101.4 U104.1(VINLDO12) U104.6(VIN1) U104.10(AVDD) U104.13(VIN2) U104.19(VINLDO1) U104.24(VINLDO2) ; port 5V0_IN
VCC_TARGET_P3V3: R134.2
~{ENABLE}: Q106.3(D) Q107.1(G) R131.2
PA01: R134.1 U104.3(nPOR) ; port PoR
PC17: Q106.1(G) R127.1 ; port ENABLE
PSU_ENABLE: R125.1 R129.2 SW101.1 SW101.2 U104.7(ENSW1) U104.12(ENSW2) U104.16(ENLDO2) U104.17(ENLDO1)
NetC114_2: C114.2 R122.1 R123.2 U104.8(FB1)
NetC116_2: C116.2 C118.1 R124.1 R126.1 U104.11(FB2)
NetL101_1: L101.1 U104.5(SW1)
NetL102_1: L102.1 U104.14(SW2)
NetQ107_3: Q107.3(D) R129.1
NetR128_1: R128.1 R130.2 U104.21(FBL1)
NetR132_1: R132.1 R133.2 U104.22(FBL2)

### Notes on the sheet
- See datasheet page 29 for reccomended PCB layout
- Iout max = 1500mA
  Accuracy 0.089%/V + 0.0013%/mA (max 2.13%)
  RDSON typ 200mΩ (400mΩ max)
  Quiescent current 33 uA (no load)
  Current limit max 500 mA
  Thermal shutdown
  Minimum input / output capacitance is 10uF
- Iout max = 1500mA
  Accuracy 0.089%/V + 0.0013%/mA (max 2.24%)
  RDSON typ 200mΩ (400mΩ max)
  Quiescent current 33 uA (no load)
  Current limit max 500 mA
  Thermal shutdown
  Minimum input / output capacitance is 10uF
- (near R125) When Q106 is open the voltage divider between R125 and R129 causes PSU_ENABLE = 0.24V, below the off-treshold of 0.4V
  Pushing down SW101 will force PSU_ENABLE = 5V.
  The regulator will be on regardless of the Enable signal level as long as SW101 is pushed.
- GPIO
- Iout max = 300mA
  Accuracy 0.15%/V + 0.011%/mA (max 3.57%)
  Dropout typical 25mV at 50mA (max 200mv)
  Quiescent current 40 uA (no load)
  Current limit max 500 mA
  Thermal shutdown
  Minimum capacitance required on output is 0.68uF (with ESR between 5 - 500mOhm)
- (near Q106) When the system is powered (supercap empty) the Enable signal will have the same ramp-up as VCC_BACKUP_P3V3 causing Vgs = 0V during the entire powerup sequence.
  This causes #ENABLE to stay sufficiently low which effectively closes Q106, ensuring PSU_ENABLE = 5V
- Iout max = 300mA
  Accuracy 0.15%/V + 0.011%/mA (max 3.48%)
  Dropout typical 25mV at 50mA (max 200mv)
  Quiescent current 40 uA (no load)
  Current limit max 500 mA
  Thermal shutdown
  Minimum capacitance required on output is 0.68uF (with ESR between 5 - 500mOhm)
- WKUP1
- (near R134) nPOR is held low (0v) by the regulator when either of the switch mode regulators outputs are not ready/good.
  On rising power flank the nPOR is let go when the output voltage reaches 92%.
  On falling power flank the nPOR is forced low when the output voltage falls below 82%.
  nPOR can be pulled to VCC_TARGET_P3V3 as the regulator won't let go of the nPOR pin before the voltage is at a sufficient level.
- Date:
- PAGE:
- of
- TITLE:
- Document number:
- Revision:

### Library data of the parts
C107 = A01-0377: Ceramic capacitor, SMD 0603, X5R, 10V, 10% (de31036); PartGroup: Capacitors,Ceramic,SMD 0603; Manufacturer: tdk; MPN: C1608X5R1A475K; TemperatureRange: -55 - +85 deg C; AN: A01-0377; Tolerance: 10%; Height: 0,800000011920929
C108-C111 = A01-0300: Ceramic capacitor, SMD 0402, X5R, 6.3V, +/-20%; PartGroup: Capacitors,Ceramic,SMD 0402; Manufacturer: Kemet; MPN: C0402C225M9PAC; Tolerance: Â±20%; TemperatureRange: -55Â°C to +85Â°C; AN: A01-0300; Height: 0,5
C112 C113 C115 C117 = A01-0360: Ceramic capacitor, SMD 0805, X5R, 10V, 10 %, (de19441); PartGroup: Capacitors,Ceramic,SMD 0805; Manufacturer: Murata; MPN: GRM21BR61A106KE19L; Tolerance: 10%; TemperatureRange: -55 - +85 deg C; AN: A01-0360; Height: 1,25
C114 = A01-0014: Ceramic capacitor, SMD 0402, NP0, 50V, +/-5%; PartGroup: Capacitors,Ceramic,SMD 0402; TemperatureRange: -55 - +125 deg C; AN: A01-0014; Tolerance: 50V, +/-5%; Height: 0,550000011920929
C116 = A01-0013: Ceramic capacitor, SMD 0402, NP0, 50V, +/-5%; PartGroup: Capacitors,Ceramic,SMD 0402; TemperatureRange: -55 - +125 deg C; AN: A01-0013; Tolerance: 50V, +/-5%; Height: 0,550000011920929
C118 = A01-0021: Ceramic capacitor, SMD 0402, NP0, 50V, +/-5%; PartGroup: Capacitors,Ceramic,SMD 0402; TemperatureRange: -55 - +125 deg C; AN: A01-0021; Tolerance: 50V, +/-5%; Height: 0,550000011920929
C119 C120 = A01-0447: Ceramic capacitor, SMD 0402, X5R, 10V, ±10 %; PartGroup: Capacitors,Ceramic,SMD 0402; Manufacturer: AVX; MPN: 0402ZD105KAT2A; AN: A01-0447; Height: 0,560000002384186
L101 L102 = A03-0197: as L100 on sheet SAMV71_Xplained_Ultra_Power_Supply; AN: A03-0197; Height: 2
Q106 = A05-0087: as Q103 on sheet SAMV71_Xplained_Ultra_Power_Supply; AN: A05-0087; Height: 1,14999997615814
Q107 = A05-0085: as Q105 on sheet SAMV71_Xplained_Ultra_Power_Multiplexer; AN: A05-0085; Height: 1,10000002384186; MPN: 2N7002,215
R122 = A02-0925: as R111 on sheet SAMV71_Xplained_Ultra_Power_Supply; AN: A02-0925; Tolerance: 1 %; Height: 0,349999994039536
R123 = A02-0264: Thick film resistor, SMD 0402, 1/16W, 1%; PartGroup: Resistors,SMD,0402 1%; TemperatureRange: -55 - +125 deg C; AN: A02-0264; Tolerance: 1 %; Height: 0,349999994039536
R124 = A02-0278: Thick film resistor, SMD 0402, 1/16W, 1%; PartGroup: Resistors,SMD,0402 1%; TemperatureRange: -55 - +125 deg C; AN: A02-0278; Tolerance: 1 %; Height: 0,349999994039536
R125 R133 = A02-0267: Thick film resistor, SMD 0402, 1/16W, 1%; PartGroup: Resistors,SMD,0402 1%; TemperatureRange: -55 - +125 deg C; AN: A02-0267; Tolerance: 1 %; Height: 0,349999994039536
R126 R134 = A02-0260: as R101 on sheet SAMV71_Xplained_Ultra_Power_Supply; AN: A02-0260; Tolerance: 1 %; Height: 0,349999994039536
R127 R131 = A02-0276: as R105 on sheet SAMV71_Xplained_Ultra_Power_Supply; AN: A02-0276; Tolerance: 1 %; Height: 0,349999994039536
R128 = A02-0923: Thick film resistor, SMD 0402, 1/16W, 1%; PartGroup: Resistors,SMD,0402 1%; TemperatureRange: -55 - +125 deg C; AN: A02-0923; Tolerance: 1 %; Height: 0,349999994039536
R129 = A02-0236: Thick film resistor, SMD 0402, 1/16W, 1%; PartGroup: Resistors,SMD,0402 1%; Manufacturer: vishay; MPN: CRCW040210K0FKED; TemperatureRange: -55 - +125 deg C; AN: A02-0236; Tolerance: 1 %; Height: 0,349999994039536
R130 = A02-0927: Thick film resistor, SMD 0402, 1/16W, 1%; PartGroup: Resistors,SMD,0402 1%; TemperatureRange: -55Â°C to +150Â°C; AN: A02-0927; Height: 0,349999994039536; Tolerance: 1 %
R132 = A02-0924: Thick film resistor, SMD 0402, 1/16W, 1%; PartGroup: Resistors,SMD,0402 1%; TemperatureRange: -55 - +125 deg C; AN: A02-0924; Tolerance: 1 %; Height: 0,349999994039536
SW101 = A08-0790: as SW100 on sheet SAMV71_Xplained_Ultra_Power_Supply; AN: A08-0790; Height: 5,09999990463257; MPN: SKRAAKE010
U104 = A06-1165: Externally Programmable Dual High-Current Step-Down DC/DC and Dual Linear Regulators; PartGroup: Integrated Circuits,Regulators,Switched; Manufacturer: Texas Instruments; MPN: LM26480SQ-AA/NOPB; TemperatureRange: -40C to 85C; AN: A06-1165; Height: 0,800000011920929

## Sheet SAMV71_Xplained_Ultra_Ethernet.SchDoc: Ethernet
size A3; Organization: ATMEL Norway; Address1: Vestre Rosten 79; Address2: N-7075 TILLER; Address3: NORWAY; DocumentNumber: A09-2407; Revision: 3; SheetNumber: 10; SheetTotal: 13; PageSetup: Record=PageOptions|CenterHorizontal=True|CenterVertical=True|PrintScale=1.04|XCorrection=1.00|YCorrection=1.00|PrintKind=1|BorderSize=5000000|LeftOffset=0|BottomOffset=0|Orientation=2|PaperLength=1000|PaperWidth=1000|Scale=100|PaperSource=7|PrintQuality=-4|MediaType=1|DitherType=10|PrintScaleMode=1|PaperKind=A3 (297 x 420 mm)|PaperIndex=8
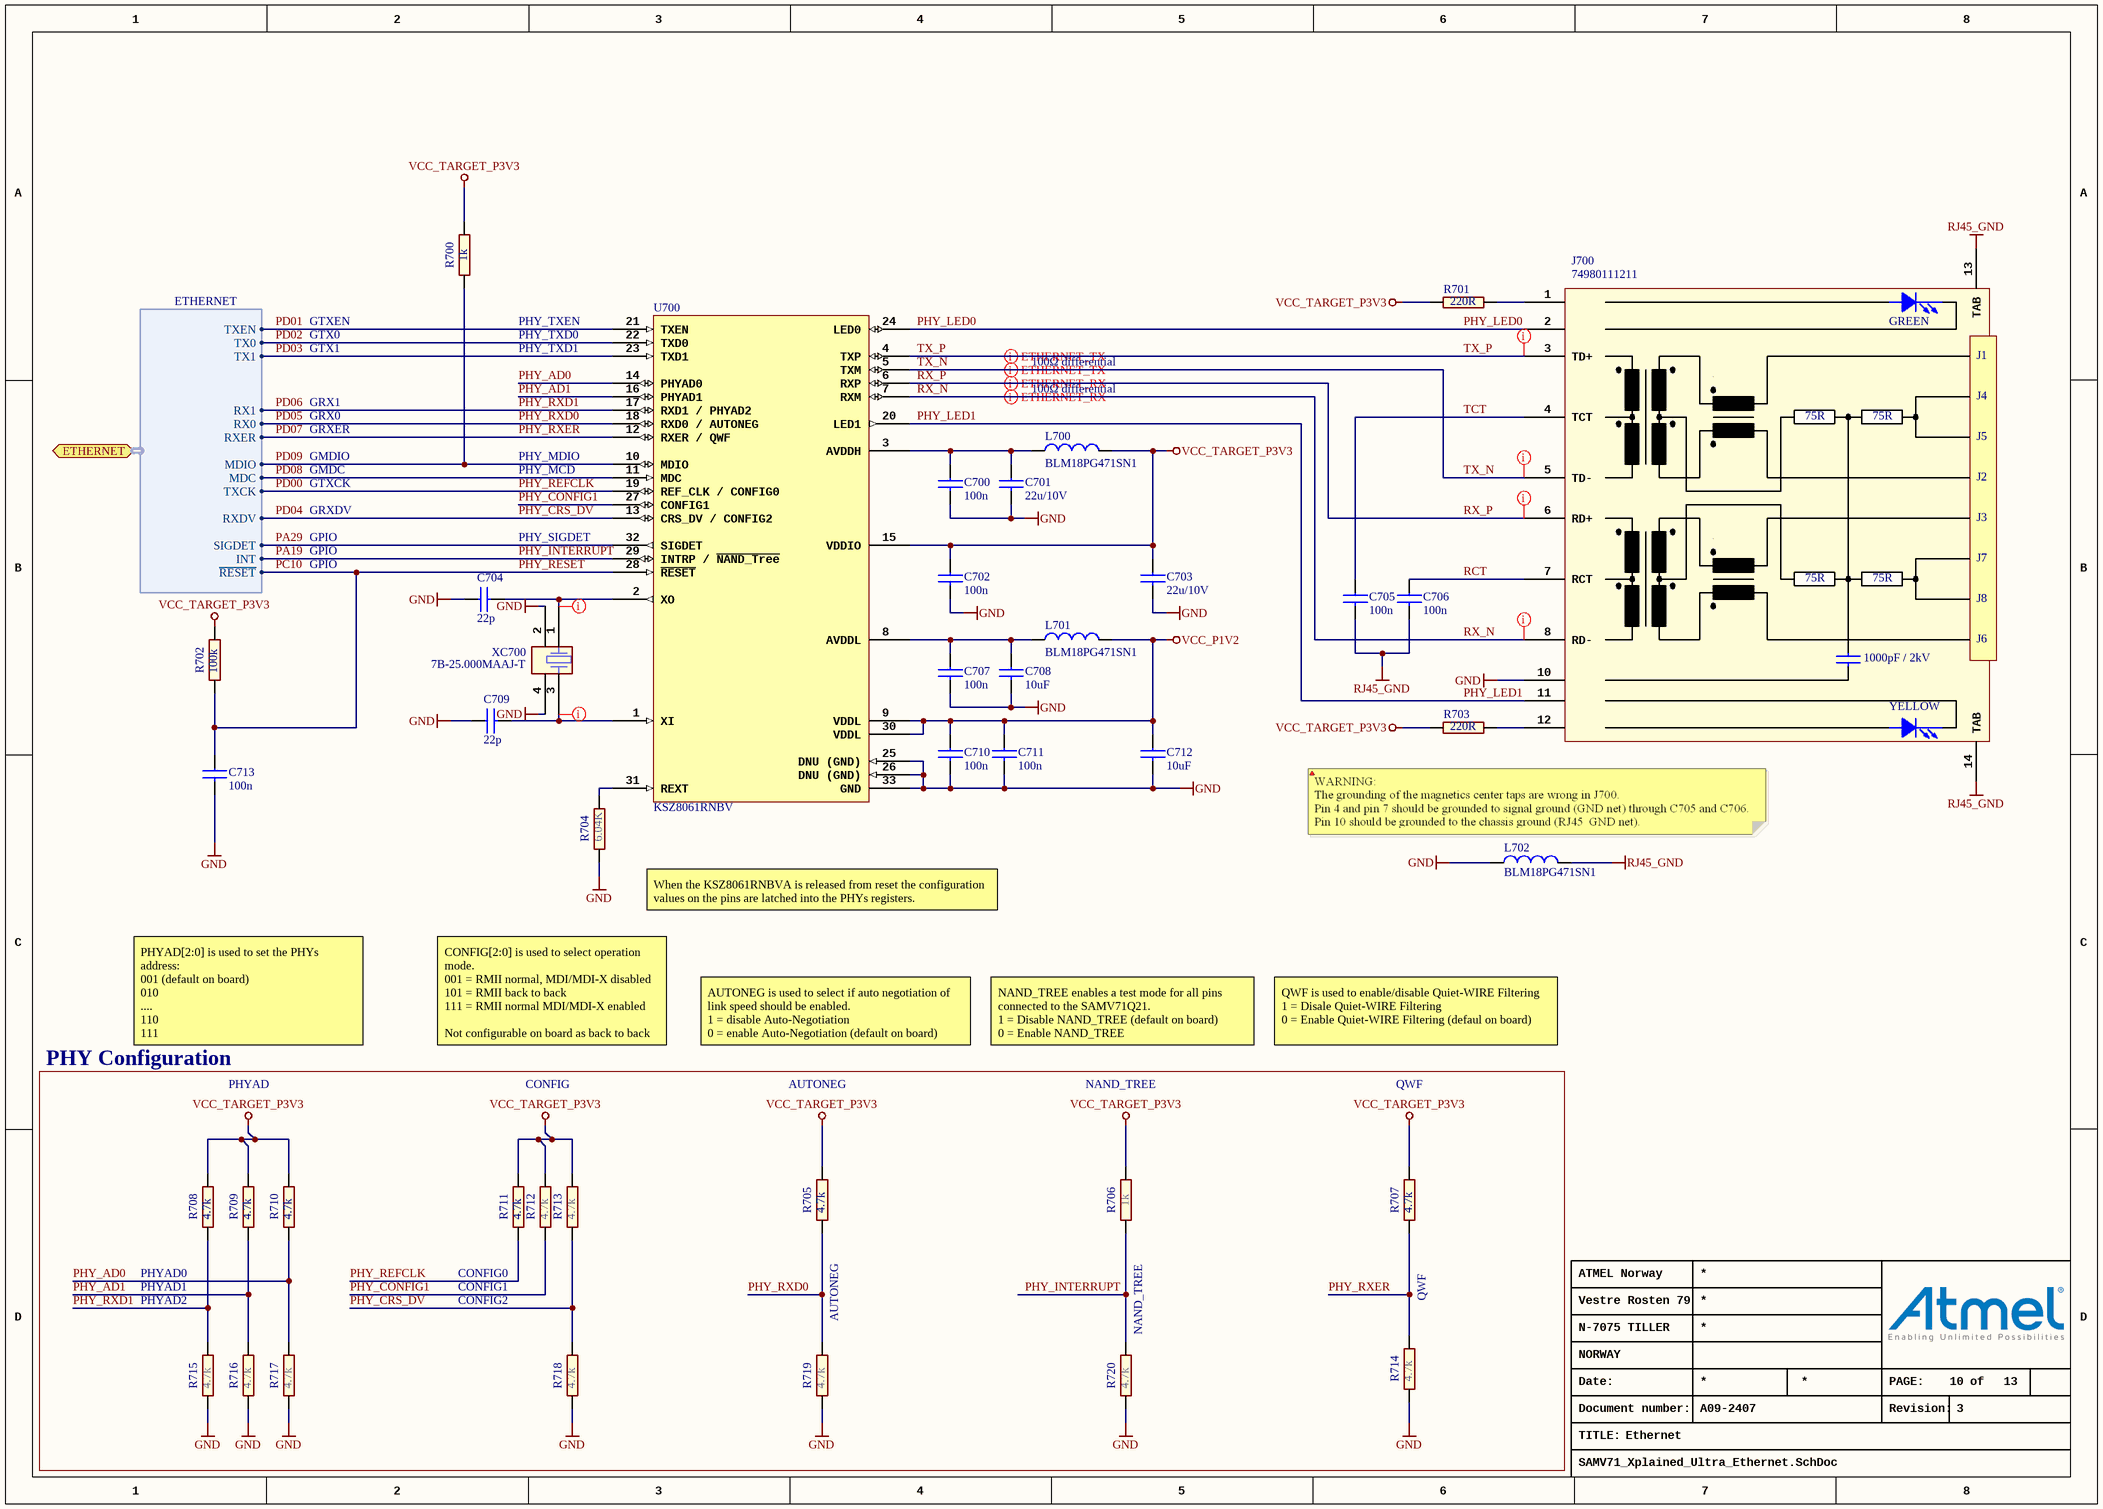
[diagram p7: SAMV71_Xplained_Ultra_Ethernet.SchDoc]

### Parts
C700  value 100n  [AP1-00001]
C701  value 22u/10V  [AP1-00003]
C702  value 100n  [AP1-00001]
C703  value 22u/10V  [AP1-00003]
C704  value 22p  [AP1-00001]
C705  value 100n  [AP1-00001]
C706  value 100n  [AP1-00001]
C707  value 100n  [AP1-00001]
C708  value 10uF  [AP1-00041]
C709  value 22p  [AP1-00001]
C710  value 100n  [AP1-00001]
C711  value 100n  [AP1-00001]
C712  value 10uF  [AP1-00041]
C713  value 100n  [AP1-00001]
J700  value 74980111211  [AP8-00749]
L700  value BLM18PG471SN1  [AP3-00005]
L701  value BLM18PG471SN1  [AP3-00005]
L702  value BLM18PG471SN1  [AP3-00005]
R700  value 1k  [AP2-00000]
R701  value 220R  [AP2-00000]
R702  value 100k  [AP2-00000]
R703  value 220R  [AP2-00000]
R704  value 6.04K  [AP2-00000]
R705  value 4.7k  [AP2-00000]
R706  value 1k  [AP2-00000]
R707  value 4.7k  [AP2-00000]
R708  value 4.7k  [AP2-00000]
R709  value 4.7k  [AP2-00000]
R710  value 4.7k  [AP2-00000]
R711  value 4.7k  [AP2-00000]
R712  value 4.7k  [AP2-00000]
R713  value 4.7k  [AP2-00000]
R714  value 4.7k  [AP2-00000]
R715  value 4.7k  [AP2-00000]
R716  value 4.7k  [AP2-00000]
R717  value 4.7k  [AP2-00000]
R718  value 4.7k  [AP2-00000]
R719  value 4.7k  [AP2-00000]
R720  value 4.7k  [AP2-00000]
U700  value KSZ8061RNBV  [AP6-00349]
XC700  value 7B-25.000MAAJ-T  [AP7-00067]

### Blocks framed on the sheet
PHY Configuration: R705-R720

### Ports
ETHERNET (harness ETHERNET)

### Harnesses
ETHERNET: TX0, TX1, TXEN, TXCK, RX0, RX1, MDC, MDIO, RXER, RXDV, INT, ~{RESET}, SIGDET

### Nets
GND: C700.2 C701.2 C702.2 C703.2 C704.1 C707.2 C708.2 C709.1 C710.2 C711.2 C712.2 C713.2 J700.10 L702.1 R704.1 R714.2 R715.2 R716.2 R717.2 R718.1 R719.2 R720.2 U700.25(DNU_(GND)) U700.26(DNU_(GND)) U700.33(GND) XC700.2 XC700.4
RJ45_GND: C705.2 C706.2 J700.13(TAB) J700.14(TAB) L702.2
VCC_P1V2: C710.1 C711.1 C712.1 L701.1 U700.9(VDDL) U700.30(VDDL)
VCC_TARGET_P3V3: C702.1 C703.1 L700.1 R700.2 R701.2 R702.2 R703.1 R705.2 R706.2 R707.2 R708.2 R709.2 R710.2 R711.2 R712.2 R713.2 U700.15(VDDIO)
~{PHY_RESET}: C713.1 R702.1 U700.28(~{RESET}) ; port ETHERNET.~{RESET}  [also labelled PC10]
PA19: R706.1 R720.1 U700.29(INTRP_/_~{NAND_Tree}) ; port ETHERNET.INT  [also labelled PHY_INTERRUPT]
PA29: U700.32(SIGDET) ; port ETHERNET.SIGDET
PD00: R711.1 U700.19(REF_CLK_/_CONFIG0) ; port ETHERNET.TXCK  [also labelled PHY_REFCLK]
PD01: U700.21(TXEN) ; port ETHERNET.TXEN
PD02: U700.22(TXD0) ; port ETHERNET.TX0
PD03: U700.23(TXD1) ; port ETHERNET.TX1
PD04: R713.1 R718.2 U700.13(CRS_DV_/_CONFIG2) ; port ETHERNET.RXDV  [also labelled PHY_CRS_DV]
PD05: R705.1 R719.1 U700.18(RXD0_/_AUTONEG) ; port ETHERNET.RX0  [also labelled PHY_RXD0]
PD06: R708.1 R715.1 U700.17(RXD1_/_PHYAD2) ; port ETHERNET.RX1  [also labelled PHY_RXD1]
PD07: R707.1 R714.1 U700.12(RXER_/_QWF) ; port ETHERNET.RXER  [also labelled PHY_RXER]
PD08: U700.11(MDC) ; port ETHERNET.MDC
PD09: R700.1 U700.10(MDIO) ; port ETHERNET.MDIO
PHY_AD0: R710.1 R717.1 U700.14(PHYAD0)
PHY_AD1: R709.1 R716.1 U700.16(PHYAD1)
PHY_CONFIG1: R712.1 U700.27(CONFIG1)
PHY_LED0: J700.2 U700.24(LED0)
PHY_LED1: J700.11 U700.20(LED1)
RCT: C706.1 J700.7(RCT)
RX_N: J700.8(RD-) U700.7(RXM)
RX_P: J700.6(RD+) U700.6(RXP)
TCT: C705.1 J700.4(TCT)
TX_N: J700.5(TD-) U700.5(TXM)
TX_P: J700.3(TD+) U700.4(TXP)
NetC700_1: C700.1 C701.1 L700.2 U700.3(AVDDH)
NetC704_2: C704.2 U700.2(XO) XC700.1
NetC707_1: C707.1 C708.1 L701.2 U700.8(AVDDL)
NetC709_2: C709.2 U700.1(XI) XC700.3
NetJ700_1: J700.1 R701.1
NetJ700_12: J700.12 R703.2
NetR704_2: R704.2 U700.31(REXT)

### Layout directives
differential pair: RX_N, RX_P, TX_N, TX_P
rule Assembly Testpoint Usage [Testpoint - Not Allowed    Multiple - Not Allowed]; rule Fabrication Testpoint Usage [Testpoint - Not Allowed    Multiple - Not Allowed]: NetC704_2, NetC709_2, RX_N, RX_P, TX_N, TX_P

### Notes on the sheet
- GTXEN
- GTX0
- GTX1
- PHY_TXEN
- PHY_TXD0
- PHY_TXD1
- 100Ω differential
- GRX1
- GRX0
- GRXER
- GMDIO
- GMDC
- GTXCK
- GRXDV
- PHY_MDIO
- PHY_MCD
- GPIO
- PHY_SIGDET
- When the KSZ8061RNBVA is released from reset the configuration values on the pins are latched into the PHYs registers.
- PHYAD[2:0] is used to set the PHYs address:
  001 (default on board)
  010
  ....
  110
  111
- CONFIG[2:0] is used to select operation mode.
  001 = RMII normal, MDI/MDI-X disabled
  101 = RMII back to back
  111 = RMII normal MDI/MDI-X enabled
  Not configurable on board as back to back mode is not applicable for this design.
- AUTONEG is used to select if auto negotiation of link speed should be enabled.
  1 = disable Auto-Negotiation
  0 = enable Auto-Negotiation (default on board)
- NAND_TREE enables a test mode for all pins connected to the SAMV71Q21.
  1 = Disable NAND_TREE (default on board)
  0 = Enable NAND_TREE
- QWF is used to enable/disable Quiet-WIRE Filtering
  1 = Disale Quiet-WIRE Filtering
  0 = Enable Quiet-WIRE Filtering (defaul on board)
- PHYAD
- CONFIG
- AUTONEG
- NAND_TREE
- QWF
- PHYAD0
- PHYAD1
- PHYAD2
- CONFIG0
- CONFIG1
- CONFIG2
- (near R719) AUTONEG
- (near R720) NAND_TREE
- Date:
- PAGE:
- of
- TITLE:
- Document number:
- Revision:
- (in symbol A08-1816) GREEN; J1; J4; 75R; J5; J2; J3; J7; J8; J6; 1000pF / 2kV; YELLOW

### Library data of the parts
C700 C702 C705-C707 C710 C711 C713 = A01-0246: as C121 on sheet SAMV71_Xplained_Ultra_Power_Supply; AN: A01-0246; Tolerance: 16V, +/-10%; Height: 0,5
C701 C703 = A01-0500: Ceramic capacitor, SMD 0805, X5R, 10V, ±20%; PartGroup: Capacitors,Ceramic,SMD 0805; Manufacturer: tdk; MPN: C2012X5R1A226M/0.85; TemperatureRange: -55Â°C to +85Â°C; AN: A01-0500; Height: 0,949999988079071
C704 C709 = A01-0019: Ceramic capacitor, SMD 0402, NP0, 50V, +/-5%; PartGroup: Capacitors,Ceramic,SMD 0402; TemperatureRange: -55 - +125 deg C; AN: A01-0019; Tolerance: 50V, +/-5%; Height: 0,550000011920929
C708 C712 = A01-0360: Ceramic capacitor, SMD 0805, X7R, 10V, 10 %, (de19441); PartGroup: Capacitors,Ceramic,SMD 0805; Manufacturer: Murata; MPN: GRM21BR61A106KE19L; Tolerance: 10%; TemperatureRange: -55 - +85 deg C; AN: A01-0360; Height: 1,25
J700 = A08-1816: 10/100Base-TX, SMD, RJ45, green and yellow LEDs, integrated magnetics; PartGroup: Mechanical devices,Connectors,Other; Manufacturer: Wurth Elektronik; TemperatureRange: -40°C to +85°C; AN: A08-1816; Height: 13,6099996566772; MPN: 74980111211
L700-L702 = A03-0035: SMD RF inductor 0603. Z=470Ohm (@100MHz), Max R(dc)=0.65Ohm, Max current=1A; PartGroup: Inductors,EMI; Manufacturer: Murata; Tolerance: ±25%; TemperatureRange: -55°C to +125°C; AN: A03-0035; Height: 0,800000011920929; MPN: BLM18PG471SN1
R700 R706 = A02-0212: Thick film resistor, SMD 0402, 1/16W, 1%; PartGroup: Resistors,SMD,0402 1%; TemperatureRange: -55 - +125 deg C; AN: A02-0212; Tolerance: 1 %; Height: 0,349999994039536
R701 R703 = A02-0196: Thick film resistor, SMD 0402, 1/16W, 1%; PartGroup: Resistors,SMD,0402 1%; TemperatureRange: -55 - +125 deg C; AN: A02-0196; Tolerance: 1 %; Height: 0,349999994039536
R702 = A02-0260: as R101 on sheet SAMV71_Xplained_Ultra_Power_Supply; AN: A02-0260; Tolerance: 1 %; Height: 0,349999994039536
R704 = A02-0914: Thick film resistor, SMD 0402, 1/16W, 1%, E192; PartGroup: Resistors,SMD,0402 1%; TemperatureRange: -55 to +125 deg C; AN: A02-0914; Tolerance: 1%; Height: 0,349999994039536
R705 R707-R720 = A02-0228: Thick film resistor, SMD 0402, 1/16W, 1%; PartGroup: Resistors,SMD,0402 1%; TemperatureRange: -55ï¿½ to +125ï¿½C; AN: A02-0228; Tolerance: 1 %; Height: 0,349999994039536
U700 = A06-1163: 10Base-T/100Base-TX PHY, RMII, EEE, 50MHz clock output, AEC-Q100 Automotive; PartGroup: Integrated Circuits,Interface ICs,Ethernet; Manufacturer: MICREL SEMICONDUCTOR; TemperatureRange: -40Â°C to +105Â°C; AN: A06-1163; Height: 0,850000023841858; MPN: KSZ8061RNBV
XC700 = A07-0088: 25.000 MHz crystal, 18pF, ±30ppm, 5.0 x 3.2 mm; PartGroup: Frequency devices,Crystals,SMD; Manufacturer: TXC Corporation; Tolerance: Â±30ppm; TemperatureRange: -40Â°C to +85Â°C; AN: A07-0088; Height: 1,04999995231628; MPN: 7B-25.000MAAJ-T

## Sheet SAMV71_Xplained_Ultra_Memory.SchDoc: Memory
size A3; Organization: ATMEL Norway; Address1: Vestre Rosten 79; Address2: N-7075 TILLER; Address3: NORWAY; DocumentNumber: A09-2407; Revision: 3; SheetNumber: 9; SheetTotal: 13; PageSetup: Record=PageOptions|CenterHorizontal=True|CenterVertical=True|PrintScale=1.01|XCorrection=1.00|YCorrection=1.00|PrintKind=1|BorderSize=5000000|LeftOffset=0|BottomOffset=0|Orientation=2|PaperLength=1000|PaperWidth=1000|Scale=100|PaperSource=7|PrintQuality=-4|MediaType=1|DitherType=10|PaperKind=A3 (297 x 420 mm)|PrintScaleMode=1
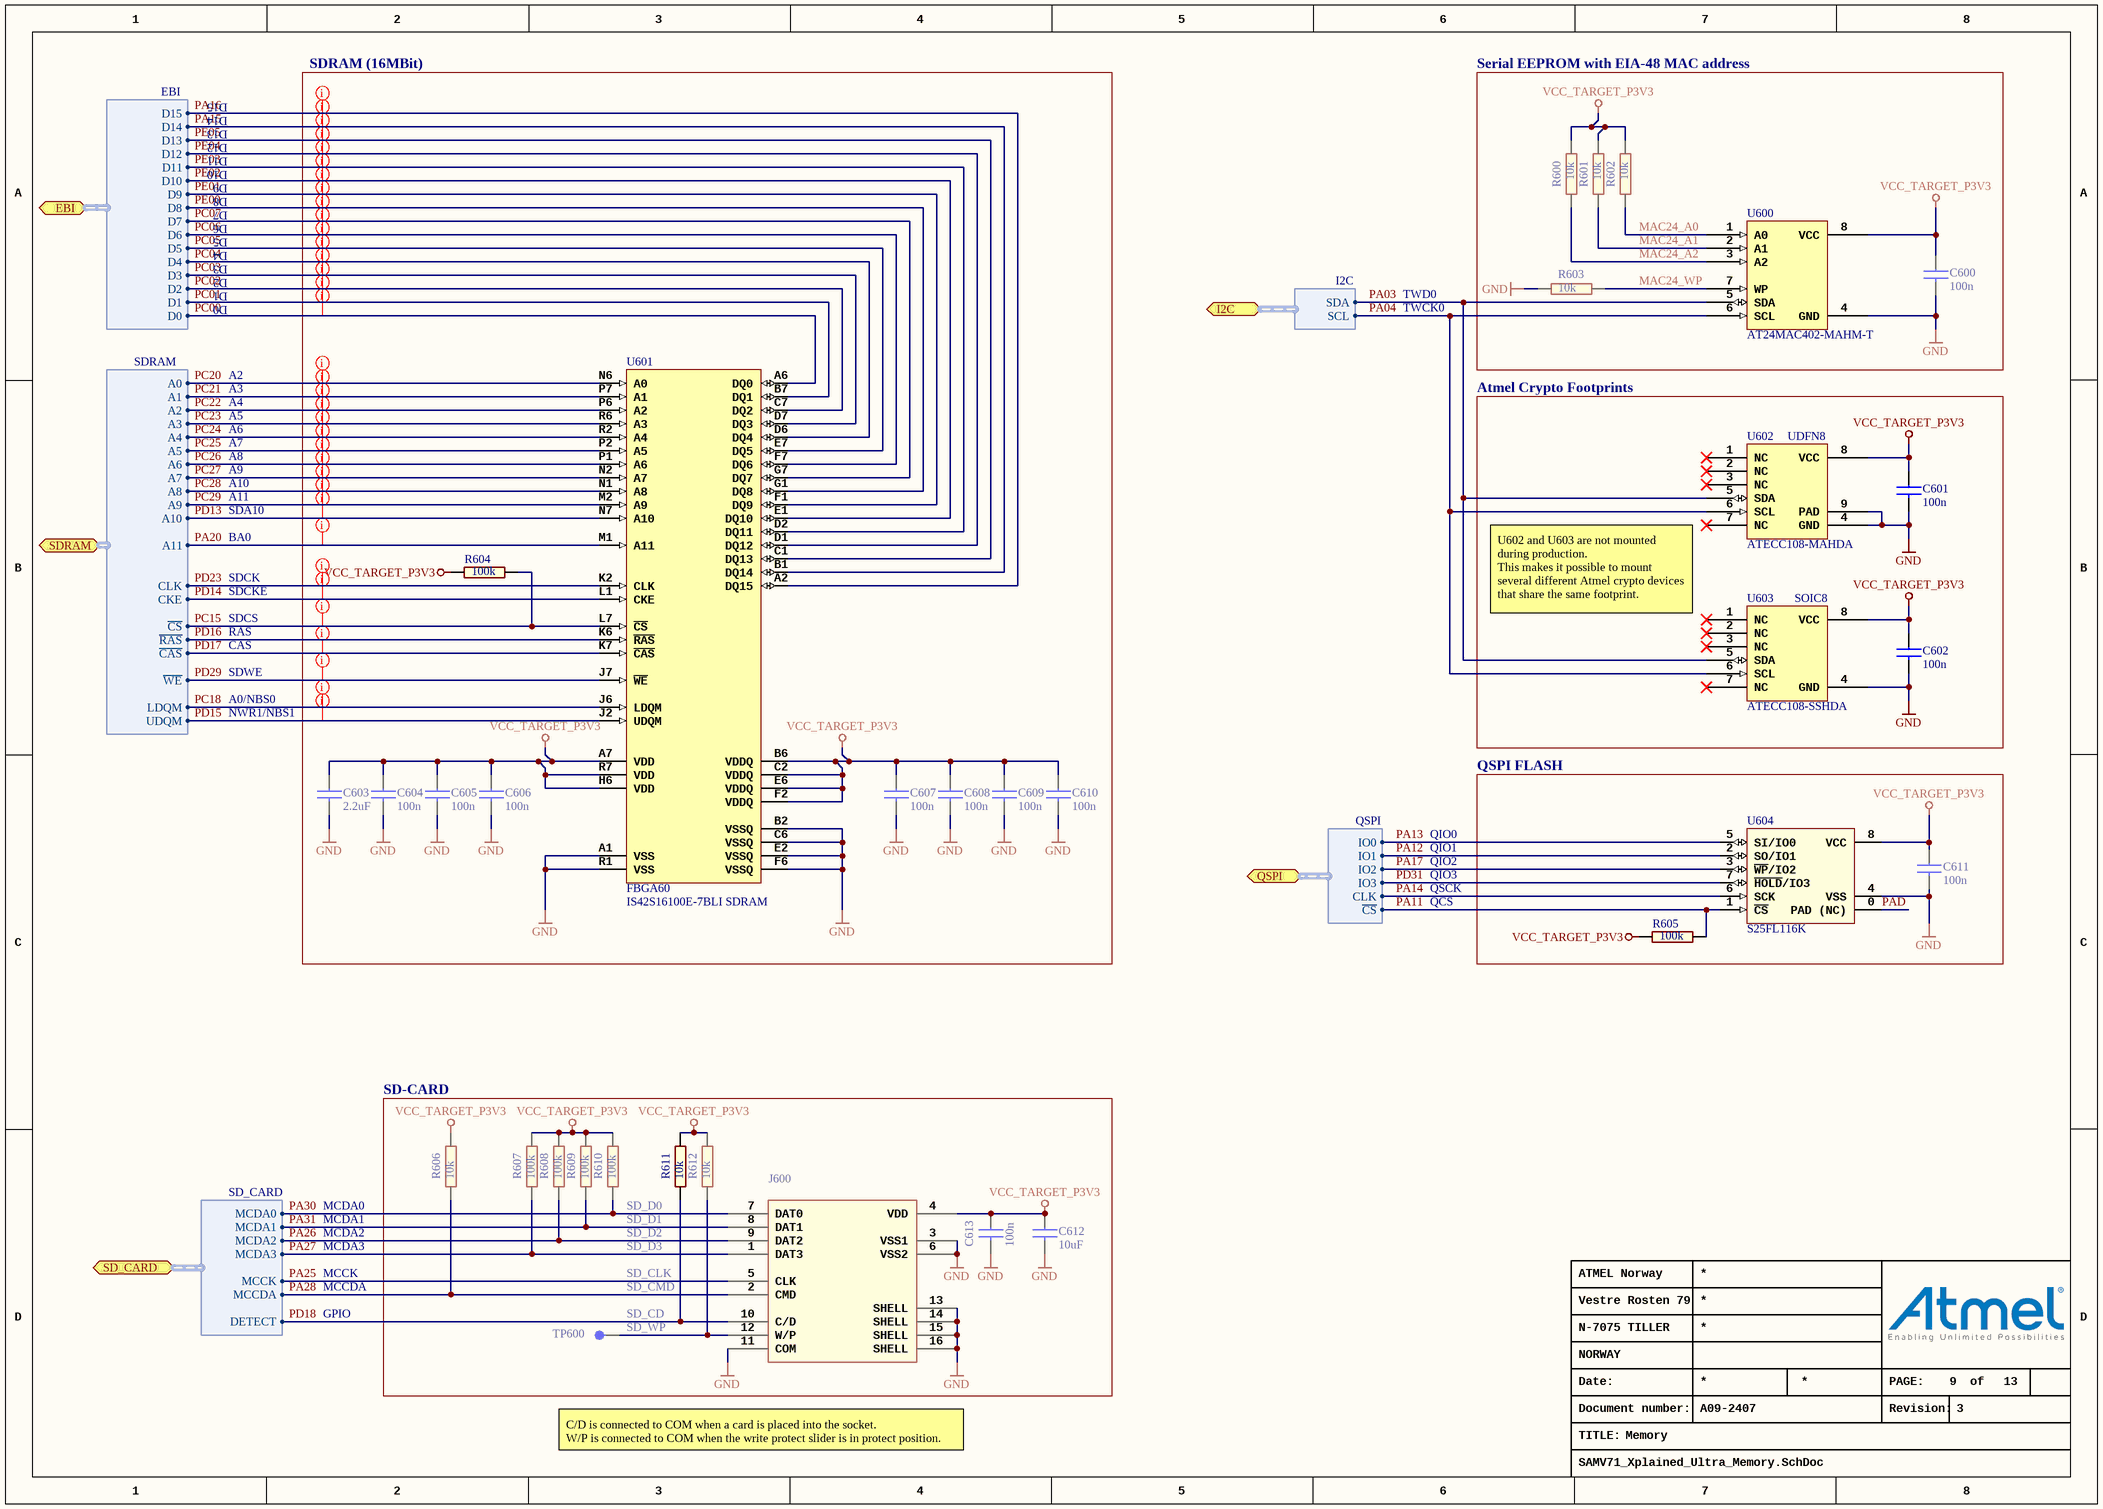
[diagram p8: SAMV71_Xplained_Ultra_Memory.SchDoc]

### Parts
C600  value 100n  [AP1-00001]
C601  value 100n  [AP1-00001]
C602  value 100n  [AP1-00001]
C603  value 2.2uF  [AP1-00053]  (hidden comment: Farnell no: 1288200)
C604  value 100n  [AP1-00053]
C605  value 100n  [AP1-00053]
C606  value 100n  [AP1-00053]
C607  value 100n  [AP1-00053]
C608  value 100n  [AP1-00053]
C609  value 100n  [AP1-00053]
C610  value 100n  [AP1-00053]
C611  value 100n  [AP1-00001]
C612  value 10uF  [AP1-00041]
C613  value 100n  [AP1-00001]
J600  (no value)  [AP8-00377]
R600  value 10k  [AP2-00000]
R601  value 10k  [AP2-00000]
R602  value 10k  [AP2-00000]
R603  value 10k  [AP2-00000]
R604  value 100k  [AP2-00000]
R605  value 100k  [AP2-00000]
R606  value 10k  [AP2-00000]
R607  value 100k  [AP2-00000]
R608  value 100k  [AP2-00000]
R609  value 100k  [AP2-00000]
R610  value 100k  [AP2-00000]
R611  value 10k  [AP2-00000]
R612  value 10k  [AP2-00000]
TP600  (no value)  [AP8-00010]  (no BOM)
U600  value AT24MAC402-MAHM-T  [AP6-00186]
U601  FBGA60  value IS42S16100E-7BLI SDRAM  [AP6-00400]
U602  value ATECC108-MAHDA  [AP6-00409]
U603  value ATECC108-SSHDA  [AP6-00071]
U604  value S25FL116K  [AP6-00402]  (hidden comment: Also available as 32- and 64-Mbit.)

### Blocks framed on the sheet
SDRAM (16MBit): C603-C610 R604 U601
Serial EEPROM with EIA-48 MAC address: C600 R600-R603 U600
Atmel Crypto Footprints: C601 C602 U602 U603
QSPI FLASH: C611 R605 U604
SD-CARD: C612 C613 J600 R606-R612 TP600

### Ports
EBI (harness EBI), I2C (harness I2C), QSPI (harness QSPI), SD_CARD (harness SD_CARD), SDRAM (harness SDRAM)

### Harnesses
SD_CARD: MCCDA, MCCK, MCDA3, MCDA2, MCDA1, MCDA0, DETECT
EBI: D0, D1, D2, D3, D4, D5, D6, D7, D8, D9, D10, D11, D12, D13, D14, D15
QSPI: CLK, IO3, IO2, IO0, IO1, ~{CS}
SDRAM: ~{CAS}, ~{RAS}, ~{CS}, CLK, CKE, ~{WE}, LDQM, UDQM, A0, A1, A2, A3, A4, A5, A6, A7, A8, A9, A10, A11
I2C: SDA, SCL

### Nets
GND: C600.2 C601.2 C602.2 C603.2 C604.2 C605.2 C606.2 C607.2 C608.2 C609.2 C610.2 C611.2 C612.2 C613.2 J600.3(VSS1) J600.6(VSS2) J600.11(COM) J600.13(SHELL) J600.14(SHELL) J600.15(SHELL) J600.16(SHELL) R603.1 U600.4(GND) U601.A1(VSS) U601.B2(VSSQ) U601.C6(VSSQ) U601.E2(VSSQ) U601.F6(VSSQ) U601.R1(VSS) U602.4(GND) U602.9(PAD) U603.4(GND) U604.4(VSS)
VCC_TARGET_P3V3: C600.1 C601.1 C602.1 C603.1 C604.1 C605.1 C606.1 C607.1 C608.1 C609.1 C610.1 C611.1 C612.1 C613.1 J600.4(VDD) R600.2 R601.2 R602.2 R604.1 R605.1 R606.2 R607.2 R608.2 R609.2 R610.2 R611.2 R612.2 U600.8(VCC) U601.A7(VDD) U601.B6(VDDQ) U601.C2(VDDQ) U601.E6(VDDQ) U601.F2(VDDQ) U601.H6(VDD) U601.R7(VDD) U602.8(VCC) U603.8(VCC) U604.8(VCC)
MAC24_A0: R602.1 U600.1(A0)
MAC24_A1: R601.1 U600.2(A1)
MAC24_A2: R600.1 U600.3(A2)
MAC24_WP: R603.2 U600.7(WP)
PA03: U600.5(SDA) U602.5(SDA) U603.5(SDA) ; port I2C.SDA
PA04: U600.6(SCL) U602.6(SCL) U603.6(SCL) ; port I2C.SCL
PA11: R605.2 U604.1(~{CS}) ; port QSPI.~{CS}
PA12: U604.2(SO/IO1) ; port QSPI.IO1
PA13: U604.5(SI/IO0) ; port QSPI.IO0
PA14: U604.6(SCK) ; port QSPI.CLK
PA15: U601.B1(DQ14) ; port EBI.D14
PA16: U601.A2(DQ15) ; port EBI.D15
PA17: U604.3(~{WP}/IO2) ; port QSPI.IO2
PA20: U601.M1(A11) ; port SDRAM.A11
PA25: J600.5(CLK) ; port SD_CARD.MCCK
PA26: J600.9(DAT2) R608.1 ; port SD_CARD.MCDA2
PA27: J600.1(DAT3) R607.1 ; port SD_CARD.MCDA3
PA28: J600.2(CMD) R606.1 ; port SD_CARD.MCCDA
PA30: J600.7(DAT0) R610.1 ; port SD_CARD.MCDA0
PA31: J600.8(DAT1) R609.1 ; port SD_CARD.MCDA1
PAD: U604.0(PAD_(NC))
PC00: U601.A6(DQ0) ; port EBI.D0
PC01: U601.B7(DQ1) ; port EBI.D1
PC02: U601.C7(DQ2) ; port EBI.D2
PC03: U601.D7(DQ3) ; port EBI.D3
PC04: U601.D6(DQ4) ; port EBI.D4
PC05: U601.E7(DQ5) ; port EBI.D5
PC06: U601.F7(DQ6) ; port EBI.D6
PC07: U601.G7(DQ7) ; port EBI.D7
PC15: R604.2 U601.L7(~{CS}) ; port SDRAM.~{CS}
PC18: U601.J6(LDQM) ; port SDRAM.LDQM
PC20: U601.N6(A0) ; port SDRAM.A0
PC21: U601.P7(A1) ; port SDRAM.A1
PC22: U601.P6(A2) ; port SDRAM.A2
PC23: U601.R6(A3) ; port SDRAM.A3
PC24: U601.R2(A4) ; port SDRAM.A4
PC25: U601.P2(A5) ; port SDRAM.A5
PC26: U601.P1(A6) ; port SDRAM.A6
PC27: U601.N2(A7) ; port SDRAM.A7
PC28: U601.N1(A8) ; port SDRAM.A8
PC29: U601.M2(A9) ; port SDRAM.A9
PD13: U601.N7(A10) ; port SDRAM.A10
PD14: U601.L1(CKE) ; port SDRAM.CKE
PD15: U601.J2(UDQM) ; port SDRAM.UDQM
PD16: U601.K6(~{RAS}) ; port SDRAM.~{RAS}
PD17: U601.K7(~{CAS}) ; port SDRAM.~{CAS}
PD18: J600.10(C/D) R611.1 ; port SD_CARD.DETECT
PD23: U601.K2(CLK) ; port SDRAM.CLK
PD29: U601.J7(~{WE}) ; port SDRAM.~{WE}
PD31: U604.7(~{HOLD}/IO3) ; port QSPI.IO3
PE00: U601.G1(DQ8) ; port EBI.D8
PE01: U601.F1(DQ9) ; port EBI.D9
PE02: U601.E1(DQ10) ; port EBI.D10
PE03: U601.D2(DQ11) ; port EBI.D11
PE04: U601.D1(DQ12) ; port EBI.D12
PE05: U601.C1(DQ13) ; port EBI.D13
NetJ600_12: J600.12(W/P) R612.1 TP600.1

Not connected (* = marked no-connect by the designer): U602 1(NC)* 2(NC)* 3(NC)* 7(NC)*; U603 1(NC)* 2(NC)* 3(NC)* 7(NC)*

### Layout directives
net class DATA_BUS: PA15, PA16, PC00, PC01, PC02, PC03, PC04, PC05, PC06, PC07, PC18, PD15, PE00, PE01, PE02, PE03, PE04, PE05
net class ADDRESS_BUS: PA20, PC15, PC20, PC21, PC22, PC23, PC24, PC25, PC26, PC27, PC28, PC29, PD13, PD14, PD17, PD23, PD29

### Notes on the sheet
- D14
- D15
- D9
- D10
- D11
- D12
- D13
- D4
- D5
- D6
- D7
- D8
- D0
- D1
- D2
- D3
- TWCK0
- TWD0
- A2
- A3
- A4
- A5
- A6
- A7
- (near U602) UDFN8
- A8
- A9
- A10
- A11
- SDA10
- BA0
- SDCK
- SDCKE
- SDCS
- RAS
- CAS
- U602 and U603 are not mounted during production.
  This makes it possible to mount several different Atmel crypto devices that share the same footprint.
- (near U603) SOIC8
- A0/NBS0
- NWR1/NBS1
- SDWE
- QIO0
- QIO1
- QIO2
- QIO3
- QSCK
- QCS
- MCDA0
- MCDA1
- MCDA2
- MCDA3
- SD_D0
- SD_D1
- SD_D2
- SD_D3
- GPIO
- MCCK
- MCCDA
- SD_CLK
- (near TP600) SD_CMD
- (near TP600) SD_CD
- (near TP600) SD_WP
- C/D is connected to COM when a card is placed into the socket.
  W/P is connected to COM when the write protect slider is in protect position.
- Date:
- PAGE:
- of
- TITLE:
- Document number:
- Revision:

### Library data of the parts
C600-C602 C604-C611 C613 = A01-0246: as C121 on sheet SAMV71_Xplained_Ultra_Power_Supply; AN: A01-0246; Tolerance: 16V, +/-10%; Height: 0,5
C603 = A01-0300: as C108-C111 on sheet SAMV71_Xplained_Ultra_Power_Converter; AN: A01-0300; Height: 0,5
C612 = A01-0360: as C112 on sheet SAMV71_Xplained_Ultra_Power_Converter; AN: A01-0360; Height: 1,25
J600 = A08-0816: SD/MMC socket, 2.7mm, push-push, SMD; PartGroup: Mechanical devices,Connectors,Memory cards; Manufacturer: Kyocera-elco; Value: KYOCERA - 14 5738 009 220 859+; TemperatureRange: -25 deg C to 90 deg C; AN: A08-0816; Height: 2,70000004768372; MPN: KYOCERA - 14 5738 009 220 859+
R600-R603 R606 R611 R612 = A02-0236: as R129 on sheet SAMV71_Xplained_Ultra_Power_Converter; AN: A02-0236; Tolerance: 1 %; Height: 0,349999994039536
R604 R605 R607-R610 = A02-0260: as R101 on sheet SAMV71_Xplained_Ultra_Power_Supply; AN: A02-0260; Tolerance: 1 %; Height: 0,349999994039536
TP600 = A08-0004: as TP100 on sheet SAMV71_Xplained_Ultra_Power_Supply; AN: A08-0004; Value: TESTPAD; Height: 0
U600 = A06-1169: 2kbit I2C EEPROM, single EUI-48 MAC, 1.7-5.5V, 2x3mm UDFN (8MA2); PartGroup: Integrated Circuits,Memory,EEPROM; Manufacturer: ATMEL; TemperatureRange: â€“40Â°C to +85Â°C; AN: A06-1169; Height: 0,600000023841858; MPN: AT24MAC402-MAHM-T
U601 = A06-1155: 16Mbit  SDRAM (512K Words x 16 Bits x 2 Banks), 143 MHz 3,3V; PartGroup: Integrated Circuits,Memory,SDRAM; Manufacturer: ISSI; MPN: IS42S16100E-7BLI; TemperatureRange: -40C to +85C; AN: A06-1155; Height: 1,20000004768372
U602 = A06-1181: Secure authentication and product validation device, EEPROM, I2C, 2.0 - 5.5V, UDFN8; PartGroup: Integrated Circuits,Special function,Encryption; Manufacturer: ATMEL; MPN: ATECC108-MAHDA-T; TemperatureRange: -40Â°C to +85Â°C; AN: A06-1181; Height: 0,600000023841858
U603 = A06-1182: Secure authentication and product validation device, EEPROM, I2C, 2.0 - 5.5V, SOIC8; PartGroup: Integrated Circuits,Special function,Encryption; Manufacturer: ATMEL; MPN: ATECC108-SSHDA-T; TemperatureRange: -40Â°C to +85Â°C; AN: A06-1182; Height: 1,75
U604 = A06-1162: 16 Mbit (2MB) SPI Quad I/O flash, 3.3V, 108MHz, WSON-8, industrial temperature; PartGroup: Integrated Circuits,Memory,FLASH; Manufacturer: Spansion; MPN: S25FL116K0XNFI013; TemperatureRange: -40Â°C to +85Â°C; AN: A06-1162; Height: 0,800000011920929